# EAGLE design evalboard-005 (EAGLE 6.5.0)
Assembly variants: Standard

## Sheet 1 of 6
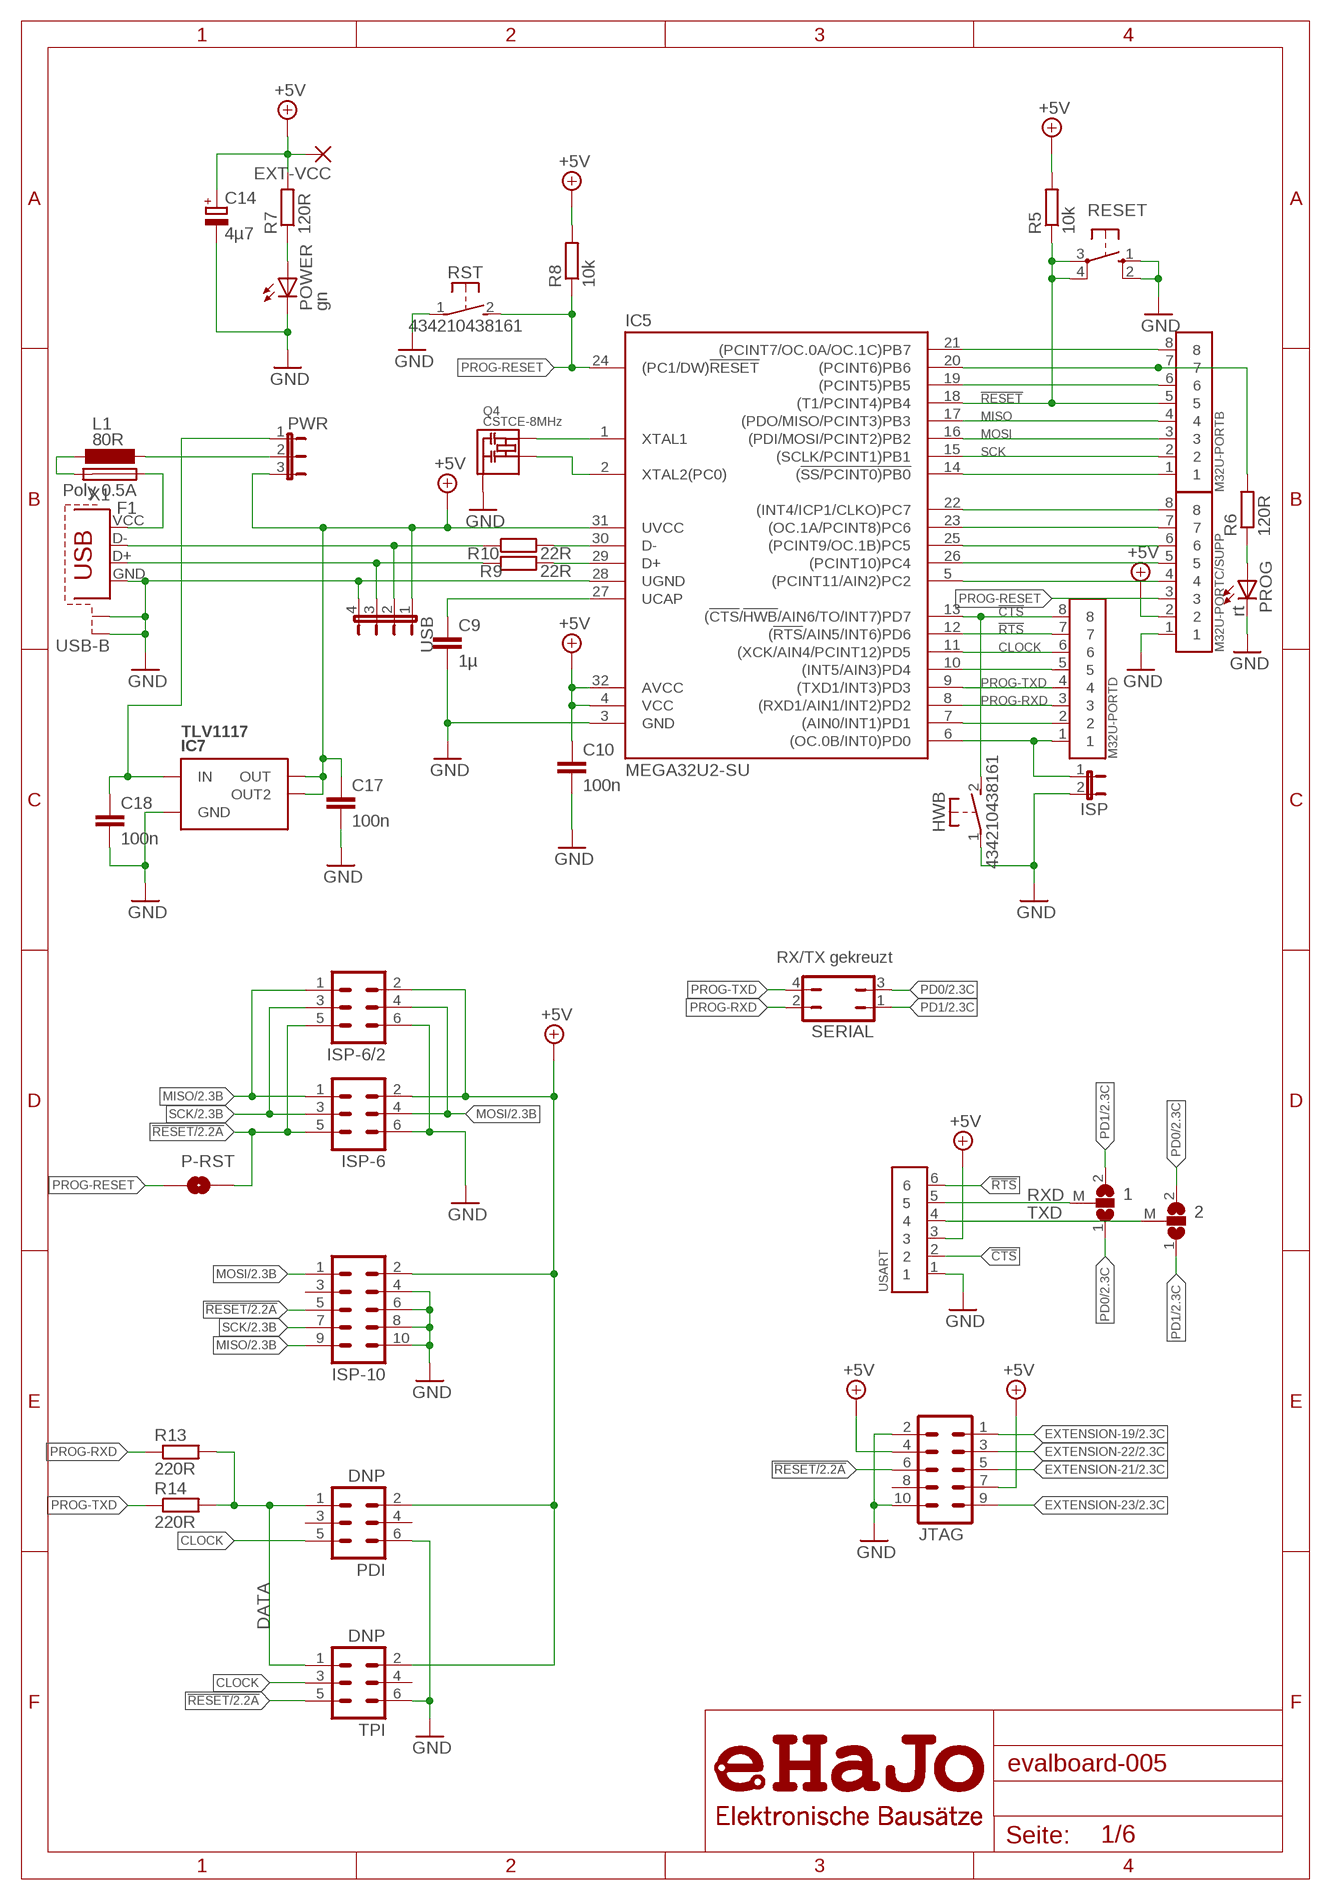
[diagram p0: schematic, sheet 1]

### Parts
1  SJ2WS  [SJ2-S]
2  SJ2WS  [SJ2-S]
C9  1µ  CC0805  [C0805]
C10  100n  CC0805  [C0805]
C14  4µ7  CPOLE2,5-6E  [E2,5-6E]
C17  100n  CC0805  [C0805]
C18  100n  CC0805  [C0805]
EXT-VCC  2,54/1,0  [2,54/1,0]
F1  Poly 0.5A  FUSE1206  [1206]
HWB  434210438161  [WS-TRS-6,0X3,5]
IC5  MEGA32U2-SU  MEGA8U-SU  [TQFP32-08]
IC7  TLV1117  [SOT-223-4]
ISP  JP1E  [JP1]
ISP-6  ML6  [ML6]
ISP-6/2  ML6  [ML6]  (not fitted in variant Standard)
ISP-10  ML10  [ML10]
JTAG  ML10  [ML10]
L1  80R  LL2012C  [L2012C]
M32U-PORTB  JP8E  [JP8E]  (not fitted in variant Standard)
M32U-PORTC/SUPP  JP8E  [JP8E]  (not fitted in variant Standard)
M32U-PORTD  JP8E  [JP8E]  (not fitted in variant Standard)
P-RST  SJS  [SJS]
PDI  DNP  ML6  [ML6]  (not fitted in variant Standard)
POWER  gn  LEDCHIP-LED0805  [CHIP-LED0805]
PROG  rt  LEDCHIP-LED0805  [CHIP-LED0805]
PWR  JP2E  [JP2]
Q4  CSTCE-8MHz  CSTCE  [SMALL-CAP]
R5  10k  RR0805  [R0805]
R6  120R  RR0805  [R0805]
R7  120R  RR0805  [R0805]
R8  10k  RR0805  [R0805]
R9  22R  RR0805  [R0805]
R10  22R  RR0805  [R0805]
R13  220R  RR0805  [R0805]  (not fitted in variant Standard)
R14  220R  RR0805  [R0805]  (not fitted in variant Standard)
RESET  10-XX  [B3F-10XX]
RST  434210438161  [WS-TRS-6,0X3,5]
SERIAL  JP2Q  [JP2Q]
TPI  DNP  ML6  [ML6]  (not fitted in variant Standard)
USART  JP6E  [JP6E]  (not fitted in variant Standard)
USB  JP4E  [JP4]  (not fitted in variant Standard)
X1  USB-B  [PN61729-S]

### Nets
!CTS: HWB.2(S) IC5.13((!CTS!/!HWB!/AIN6/TO/INT7)PD7) M32U-PORTD.8 USART.2
!RESET: IC5.18((T1/PCINT4)PB4) ISP-6.5 ISP-6/2.5 ISP-10.5 JTAG.6 M32U-PORTB.5 P-RST.2 R5.1 RESET.3(P) RESET.4(P1) TPI.5 ; also sheet 2,3,4
!RTS: IC5.12((!RTS!/AIN5/INT6)PD6) M32U-PORTD.7 USART.6
+5V [Supply]: C10.1 C14.+ C17.1 EXT-VCC.1(P) IC5.4(VCC) IC5.31(UVCC) IC5.32(AVCC) IC7.2(OUT) IC7.4(OUT2) ISP-6.2 ISP-6/2.2 ISP-10.2 JTAG.4 JTAG.7 M32U-PORTC/SUPP.2 PDI.2 PWR.3 R5.2 R7.2 R8.2 TPI.2 USART.3 USB.1 ; also sheet 2,3,4,5,6
CLOCK: IC5.11((XCK/AIN4/PCINT12)PD5) M32U-PORTD.6 PDI.5 TPI.3
D+: R9.1 USB.3 X1.D+
D-: R10.1 USB.2 X1.D-
DATA: PDI.1 R13.2 R14.2 TPI.1
EXTENSION-19: JTAG.1 ; also sheet 2,5
EXTENSION-21: JTAG.5 ; also sheet 2,5
EXTENSION-22: JTAG.3 ; also sheet 2,5
EXTENSION-23: JTAG.9 ; also sheet 2,5
GND [Supply]: C9.2 C10.2 C14.- C17.2 C18.2 HWB.1(P) IC5.3(GND) IC5.28(UGND) IC7.1(GND) ISP-6.6 ISP-6/2.6 ISP-10.4 ISP-10.6 ISP-10.8 ISP-10.10 ISP.2 JTAG.2 JTAG.10 M32U-PORTC/SUPP.1 PDI.6 POWER.C PROG.C Q4.2(GND) RESET.1(S) RESET.2(S1) RST.1(P) TPI.6 USART.1 USB.4 X1.GND X1.S1 X1.S2 ; also sheet 2,3,4,5,6
MISO: IC5.17((PDO/MISO/PCINT3)PB3) ISP-6.1 ISP-6/2.1 ISP-10.9 M32U-PORTB.4 ; also sheet 2,3,4,5
MOSI: IC5.16((PDI/MOSI/PCINT2)PB2) ISP-6.4 ISP-6/2.4 ISP-10.1 M32U-PORTB.3 ; also sheet 2,3,4,5
N$1: L1.2 PWR.2
N$3: F1.1 X1.VCC
N$4: IC5.14((!SS/PCINT0)PB0) M32U-PORTB.1
N$5: IC5.30(D-) R10.2
N$6: IC5.29(D+) R9.2
N$9: C9.1 IC5.27(UCAP)
N$11: IC5.19((PCINT5)PB5) M32U-PORTB.6
N$12: C18.1 IC7.3(IN) PWR.1
N$13: IC5.21((PCINT7/OC.0A/OC.1C)PB7) M32U-PORTB.8
N$17: IC5.10((INT5/AIN3)PD4) M32U-PORTD.5
N$20: IC5.7((AIN0/INT1)PD1) M32U-PORTD.2
N$21: IC5.20((PCINT6)PB6) M32U-PORTB.7 R6.2
N$22: IC5.6((OC.0B/INT0)PD0) ISP.1 M32U-PORTD.1
N$23: IC5.22((INT4/ICP1/CLKO)PC7) M32U-PORTC/SUPP.8
N$24: IC5.23((OC.1A/PCINT8)PC6) M32U-PORTC/SUPP.7
N$25: IC5.25((PCINT9/OC.1B)PC5) M32U-PORTC/SUPP.6
N$26: IC5.26((PCINT10)PC4) M32U-PORTC/SUPP.5
N$27: IC5.5((PCINT11/AIN2)PC2) M32U-PORTC/SUPP.4
N$39: PROG.A R6.1
N$40: POWER.A R7.1
N$41: F1.2 L1.1
N$43: IC5.1(XTAL1) Q4.1(Q1)
N$44: IC5.2(XTAL2(PC0)) Q4.3(Q2)
PD0: 1.1 2.2 SERIAL.3 ; also sheet 2,3,4,5
PD1: 1.2 2.1 SERIAL.1 ; also sheet 2,3,4,5
PROG-RESET: IC5.24((PC1/DW)!RESET) M32U-PORTC/SUPP.3 P-RST.1 R8.1 RST.2(S)
PROG-RXD: IC5.8((RXD1/AIN1/INT2)PD2) M32U-PORTD.3 R13.1 SERIAL.2
PROG-TXD: IC5.9((TXD1/INT3)PD3) M32U-PORTD.4 R14.1 SERIAL.4
RXD: 1.M USART.5
SCK: IC5.15((SCLK/PCINT1)PB1) ISP-6.3 ISP-6/2.3 ISP-10.7 M32U-PORTB.2 ; also sheet 2,3,4,5
TXD: 2.M USART.4
Unconnected: ISP-10.3 JTAG.8 PDI.3 PDI.4 TPI.4

### Notes on the sheet
- RX/TX gekreuzt

## Sheet 2 of 6
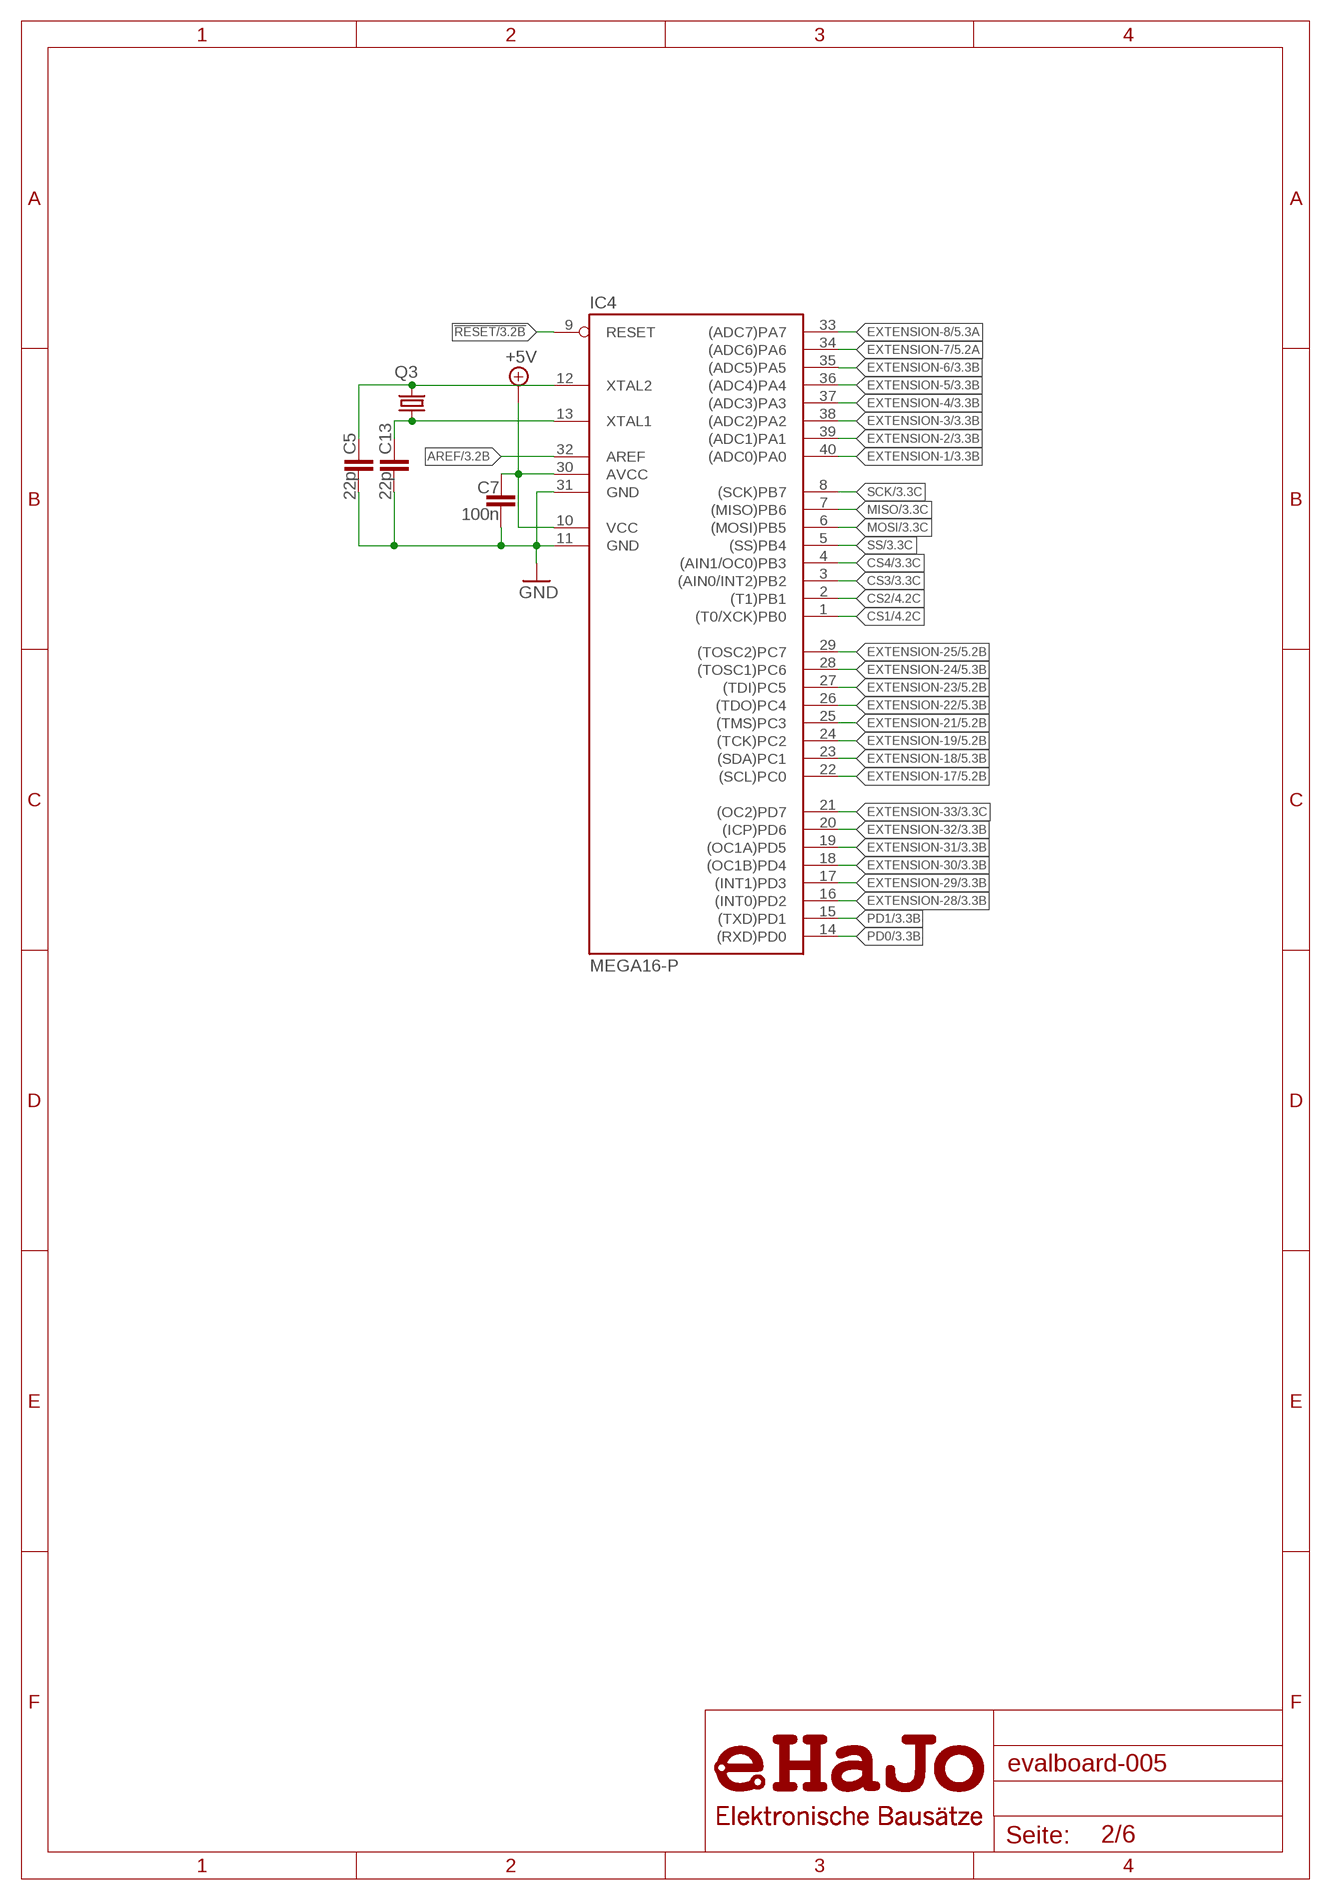
[diagram p1: schematic, sheet 2]

### Parts
C5  22p  CC0805  [C0805]
C7  100n  CC0805  [C0805]
C13  22p  CC0805  [C0805]
IC4  MEGA16-P  [DIL40]
Q3  CRYSTALHC49U70  [HC49U70]

### Nets
!RESET: IC4.9(RESET) ; also sheet 1,3,4
+5V [Supply]: C7.1 IC4.10(VCC) IC4.30(AVCC) ; also sheet 1,3,4,5,6
AREF: IC4.32(AREF) ; also sheet 3,5
CS1: IC4.1((T0/XCK)PB0) ; also sheet 4,5
CS2: IC4.2((T1)PB1) ; also sheet 4,5
CS3: IC4.3((AIN0/INT2)PB2) ; also sheet 3,4,5
CS4: IC4.4((AIN1/OC0)PB3) ; also sheet 3,4,5
EXTENSION-1: IC4.40((ADC0)PA0) ; also sheet 3,5,6
EXTENSION-2: IC4.39((ADC1)PA1) ; also sheet 3,5,6
EXTENSION-3: IC4.38((ADC2)PA2) ; also sheet 3,5
EXTENSION-4: IC4.37((ADC3)PA3) ; also sheet 3,5
EXTENSION-5: IC4.36((ADC4)PA4) ; also sheet 3,5,6
EXTENSION-6: IC4.35((ADC5)PA5) ; also sheet 3,5,6
EXTENSION-7: IC4.34((ADC6)PA6) ; also sheet 5
EXTENSION-8: IC4.33((ADC7)PA7) ; also sheet 5
EXTENSION-17: IC4.22((SCL)PC0) ; also sheet 5,6
EXTENSION-18: IC4.23((SDA)PC1) ; also sheet 5,6
EXTENSION-19: IC4.24((TCK)PC2) ; also sheet 1,5
EXTENSION-21: IC4.25((TMS)PC3) ; also sheet 1,5
EXTENSION-22: IC4.26((TDO)PC4) ; also sheet 1,5
EXTENSION-23: IC4.27((TDI)PC5) ; also sheet 1,5
EXTENSION-24: IC4.28((TOSC1)PC6) ; also sheet 5
EXTENSION-25: IC4.29((TOSC2)PC7) ; also sheet 5
EXTENSION-28: IC4.16((INT0)PD2) ; also sheet 3,4,5,6
EXTENSION-29: IC4.17((INT1)PD3) ; also sheet 3,4,5,6
EXTENSION-30: IC4.18((OC1B)PD4) ; also sheet 3,4,5,6
EXTENSION-31: IC4.19((OC1A)PD5) ; also sheet 3,4,5,6
EXTENSION-32: IC4.20((ICP)PD6) ; also sheet 3,4,5,6
EXTENSION-33: IC4.21((OC2)PD7) ; also sheet 3,5,6
GND [Supply]: C5.2 C7.2 C13.2 IC4.11(GND) IC4.31(GND) ; also sheet 1,3,4,5,6
MISO: IC4.7((MISO)PB6) ; also sheet 1,3,4,5
MOSI: IC4.6((MOSI)PB5) ; also sheet 1,3,4,5
N$19: C5.1 IC4.12(XTAL2) Q3.2
N$28: C13.1 IC4.13(XTAL1) Q3.1
PD0: IC4.14((RXD)PD0) ; also sheet 1,3,4,5
PD1: IC4.15((TXD)PD1) ; also sheet 1,3,4,5
SCK: IC4.8((SCK)PB7) ; also sheet 1,3,4,5
SS: IC4.5((SS)PB4) ; also sheet 3,4,5

## Sheet 3 of 6
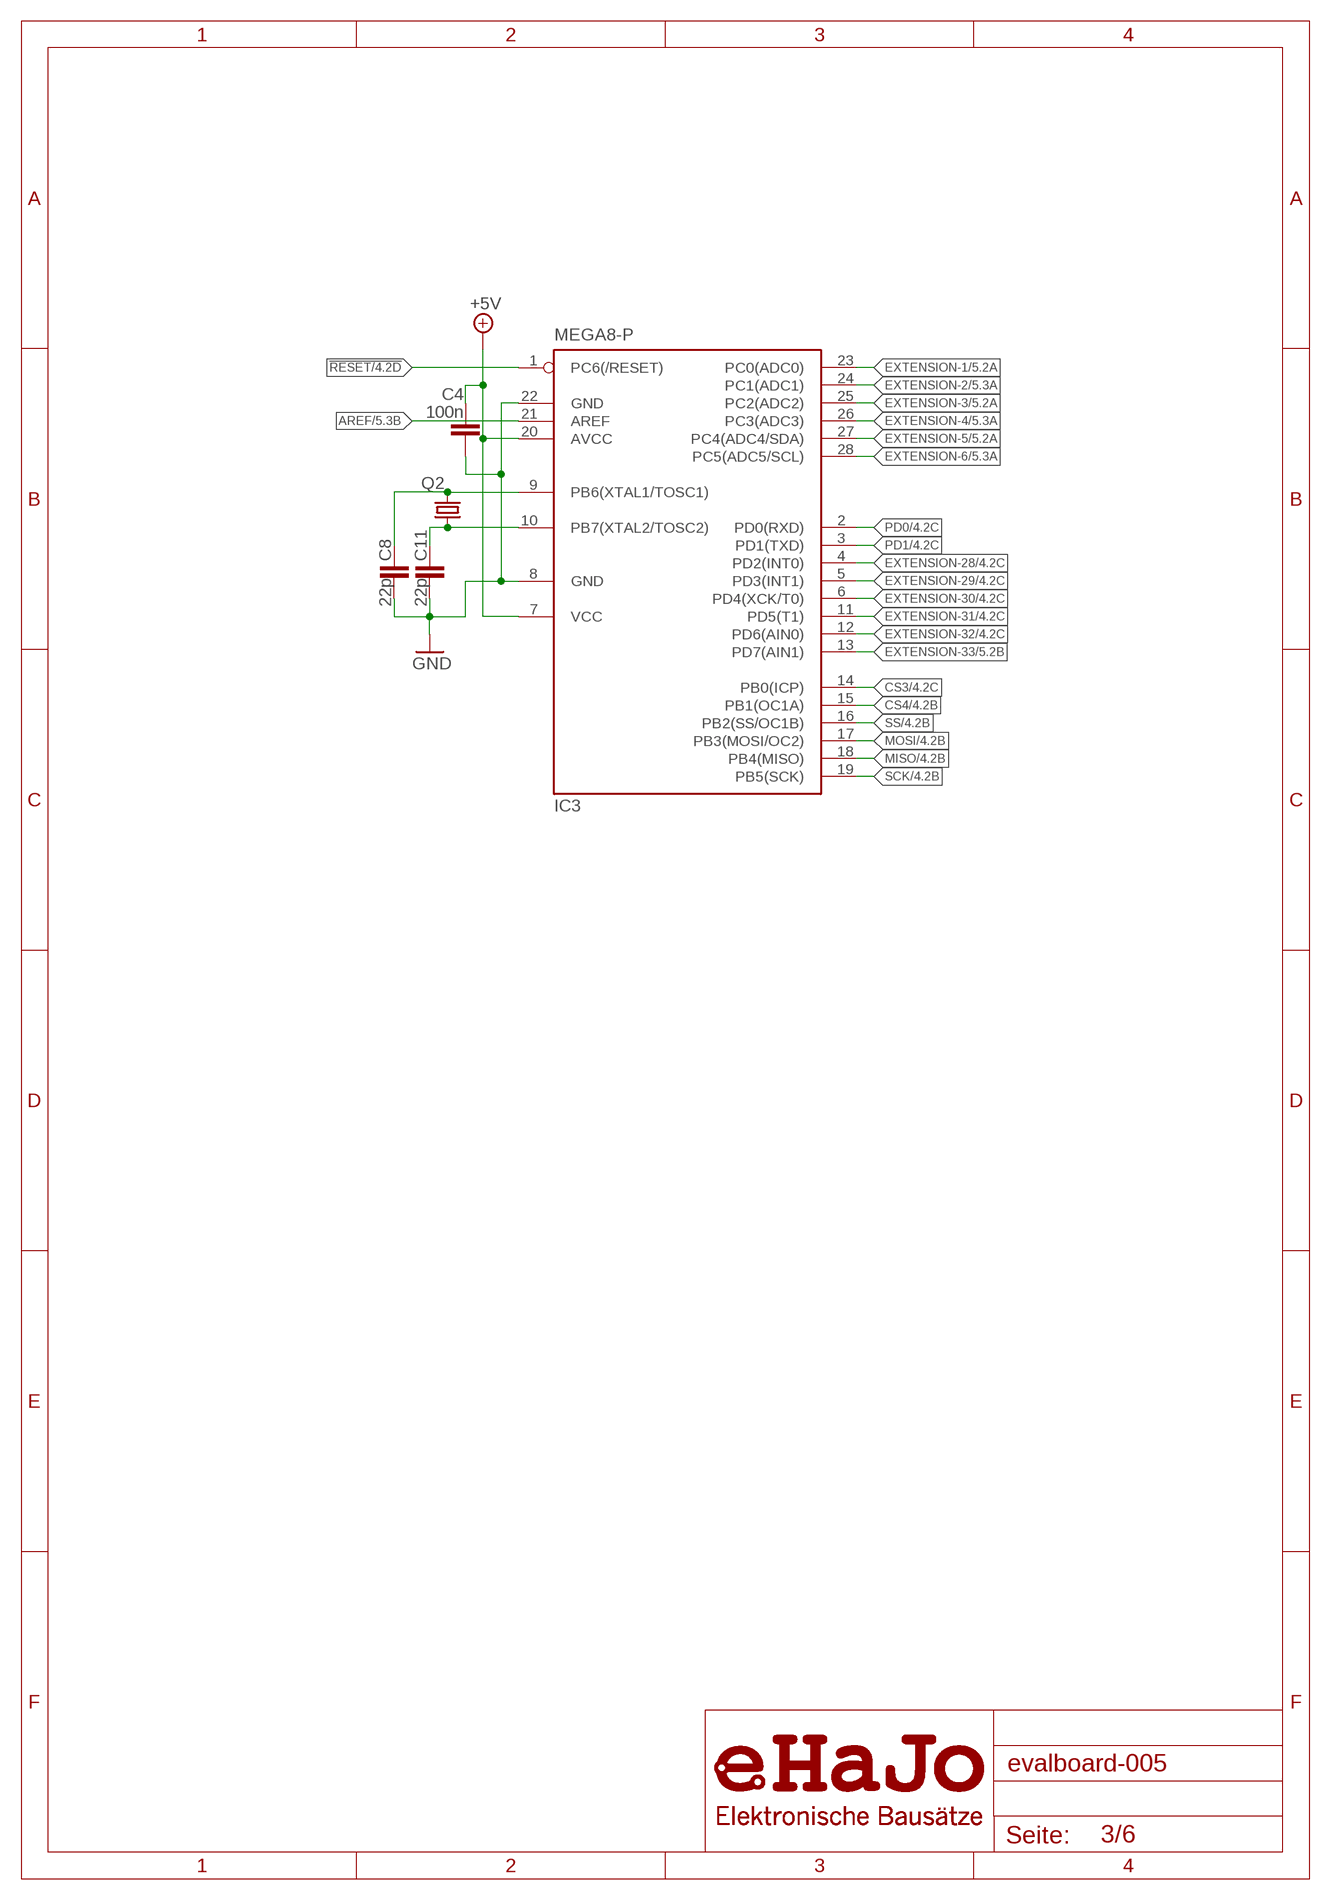
[diagram p2: schematic, sheet 3]

### Parts
C4  100n  CC0805  [C0805]
C8  22p  CC0805  [C0805]
C11  22p  CC0805  [C0805]
IC3  MEGA8-P  [DIL28-3]
Q2  CRYSTALHC49U70  [HC49U70]

### Nets
!RESET: IC3.1(PC6(/RESET)) ; also sheet 1,2,4
+5V [Supply]: C4.1 IC3.7(VCC) IC3.20(AVCC) ; also sheet 1,2,4,5,6
AREF: IC3.21(AREF) ; also sheet 2,5
CS3: IC3.14(PB0(ICP)) ; also sheet 2,4,5
CS4: IC3.15(PB1(OC1A)) ; also sheet 2,4,5
EXTENSION-1: IC3.23(PC0(ADC0)) ; also sheet 2,5,6
EXTENSION-2: IC3.24(PC1(ADC1)) ; also sheet 2,5,6
EXTENSION-3: IC3.25(PC2(ADC2)) ; also sheet 2,5
EXTENSION-4: IC3.26(PC3(ADC3)) ; also sheet 2,5
EXTENSION-5: IC3.27(PC4(ADC4/SDA)) ; also sheet 2,5,6
EXTENSION-6: IC3.28(PC5(ADC5/SCL)) ; also sheet 2,5,6
EXTENSION-28: IC3.4(PD2(INT0)) ; also sheet 2,4,5,6
EXTENSION-29: IC3.5(PD3(INT1)) ; also sheet 2,4,5,6
EXTENSION-30: IC3.6(PD4(XCK/T0)) ; also sheet 2,4,5,6
EXTENSION-31: IC3.11(PD5(T1)) ; also sheet 2,4,5,6
EXTENSION-32: IC3.12(PD6(AIN0)) ; also sheet 2,4,5,6
EXTENSION-33: IC3.13(PD7(AIN1)) ; also sheet 2,5,6
GND [Supply]: C4.2 C8.2 C11.2 IC3.8(GND) IC3.22(GND) ; also sheet 1,2,4,5,6
MISO: IC3.18(PB4(MISO)) ; also sheet 1,2,4,5
MOSI: IC3.17(PB3(MOSI/OC2)) ; also sheet 1,2,4,5
N$10: C8.1 IC3.9(PB6(XTAL1/TOSC1)) Q2.2
N$18: C11.1 IC3.10(PB7(XTAL2/TOSC2)) Q2.1
PD0: IC3.2(PD0(RXD)) ; also sheet 1,2,4,5
PD1: IC3.3(PD1(TXD)) ; also sheet 1,2,4,5
SCK: IC3.19(PB5(SCK)) ; also sheet 1,2,4,5
SS: IC3.16(PB2(SS/OC1B)) ; also sheet 2,4,5

## Sheet 4 of 6
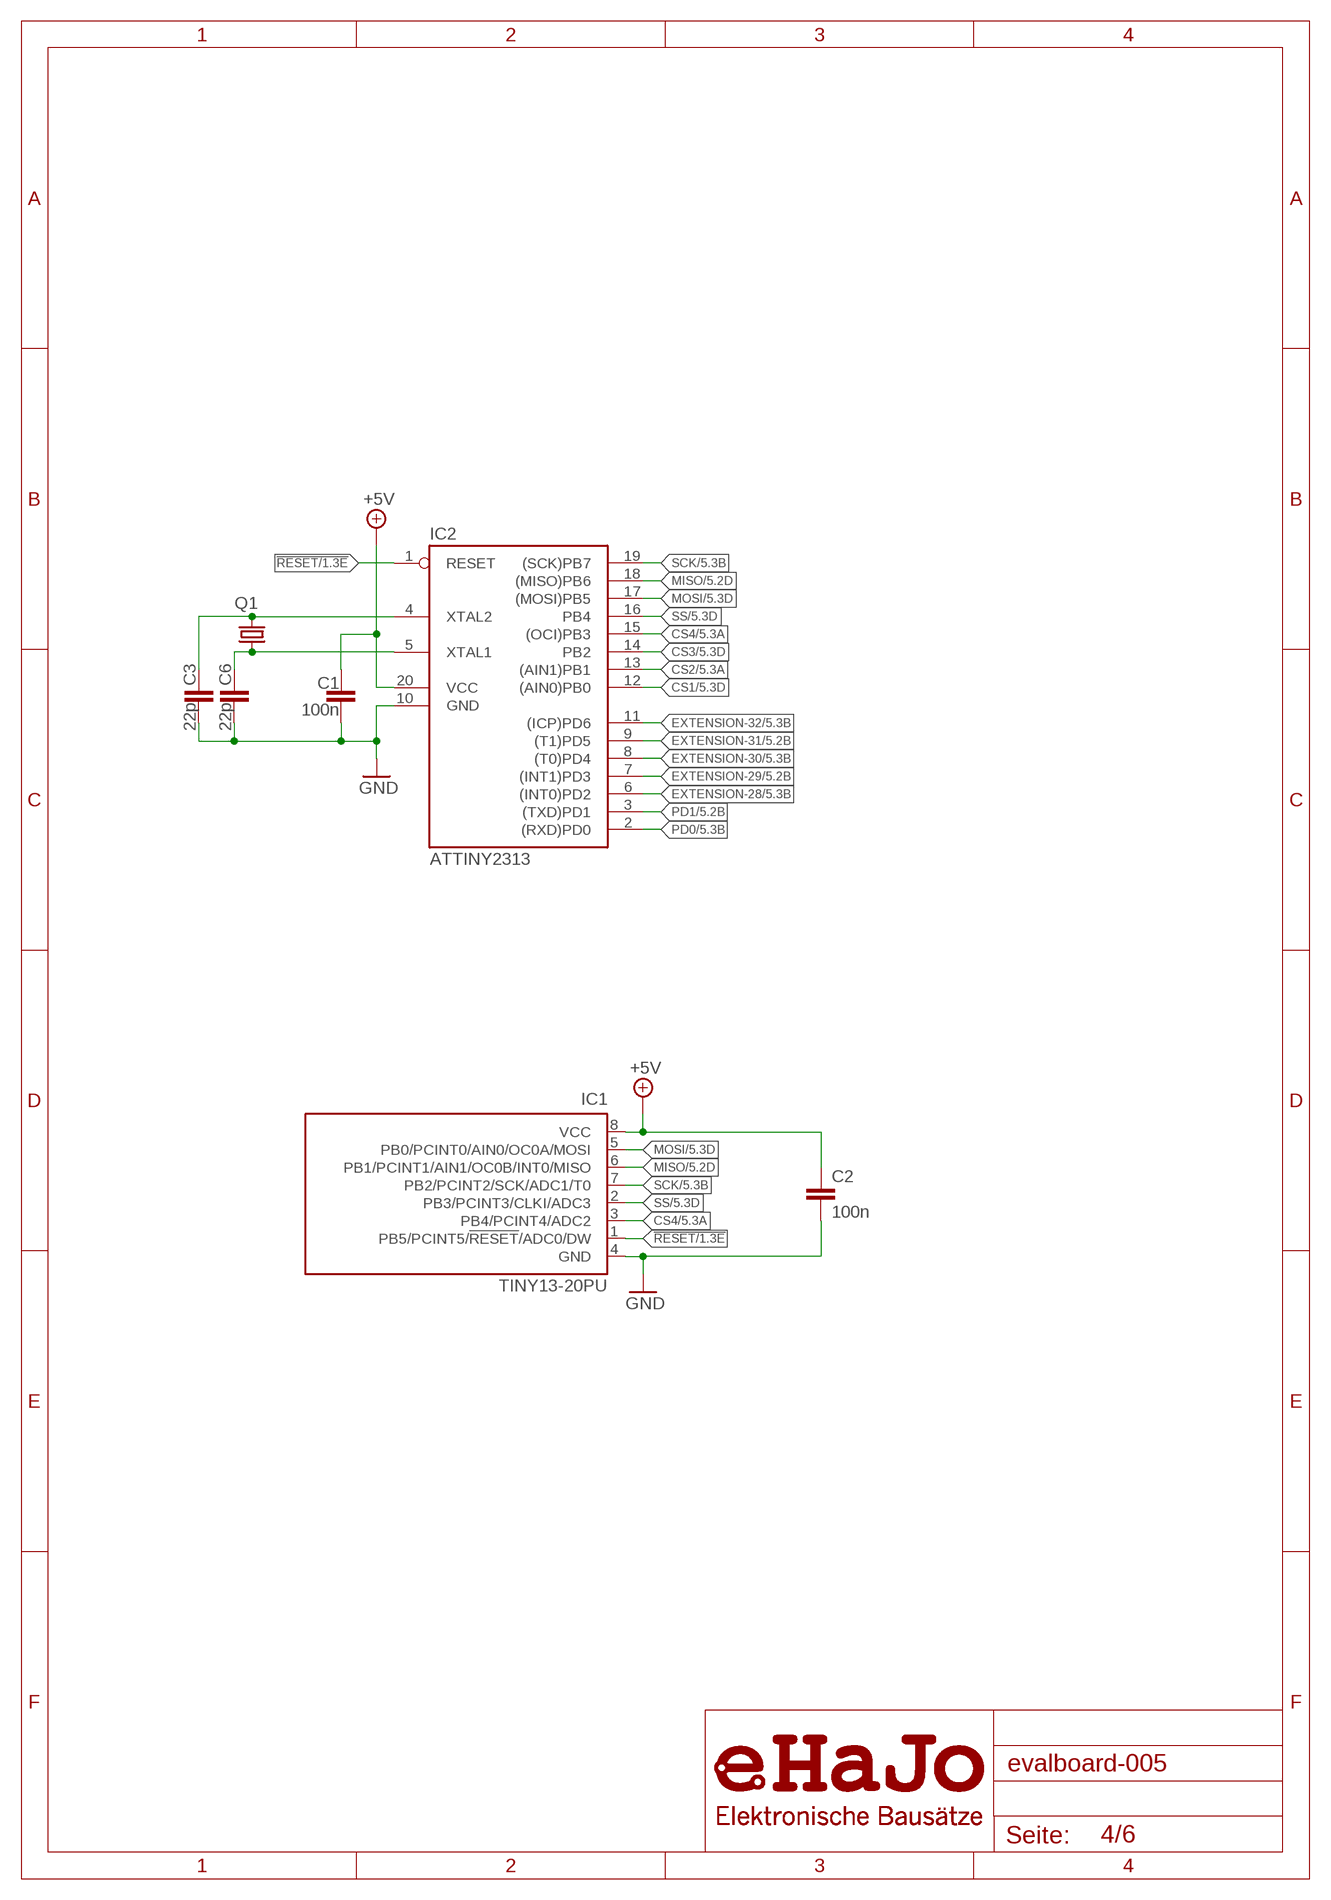
[diagram p3: schematic, sheet 4]

### Parts
C1  100n  CC0805  [C0805]
C2  100n  CC0805  [C0805]
C3  22p  CC0805  [C0805]
C6  22p  CC0805  [C0805]
IC1  TINY13-20PU  [DIL08]
IC2  ATTINY2313  AT90S2313P  [DIL20]
Q1  CRYSTALHC49U70  [HC49U70]

### Nets
!RESET: IC1.1(PB5/PCINT5/!RESET!/ADC0/DW) IC2.1(RESET) ; also sheet 1,2,3
+5V [Supply]: C1.1 C2.1 IC1.8(VCC) IC2.20(VCC) ; also sheet 1,2,3,5,6
CS1: IC2.12((AIN0)PB0) ; also sheet 2,5
CS2: IC2.13((AIN1)PB1) ; also sheet 2,5
CS3: IC2.14(PB2) ; also sheet 2,3,5
CS4: IC1.3(PB4/PCINT4/ADC2) IC2.15((OCI)PB3) ; also sheet 2,3,5
EXTENSION-28: IC2.6((INT0)PD2) ; also sheet 2,3,5,6
EXTENSION-29: IC2.7((INT1)PD3) ; also sheet 2,3,5,6
EXTENSION-30: IC2.8((T0)PD4) ; also sheet 2,3,5,6
EXTENSION-31: IC2.9((T1)PD5) ; also sheet 2,3,5,6
EXTENSION-32: IC2.11((ICP)PD6) ; also sheet 2,3,5,6
GND [Supply]: C1.2 C2.2 C3.2 C6.2 IC1.4(GND) IC2.10(GND) ; also sheet 1,2,3,5,6
MISO: IC1.6(PB1/PCINT1/AIN1/OC0B/INT0/MISO) IC2.18((MISO)PB6) ; also sheet 1,2,3,5
MOSI: IC1.5(PB0/PCINT0/AIN0/OC0A/MOSI) IC2.17((MOSI)PB5) ; also sheet 1,2,3,5
N$29: C3.1 IC2.4(XTAL2) Q1.2
N$30: C6.1 IC2.5(XTAL1) Q1.1
PD0: IC2.2((RXD)PD0) ; also sheet 1,2,3,5
PD1: IC2.3((TXD)PD1) ; also sheet 1,2,3,5
SCK: IC1.7(PB2/PCINT2/SCK/ADC1/T0) IC2.19((SCK)PB7) ; also sheet 1,2,3,5
SS: IC1.2(PB3/PCINT3/CLKI/ADC3) IC2.16(PB4) ; also sheet 2,3,5

## Sheet 5 of 6
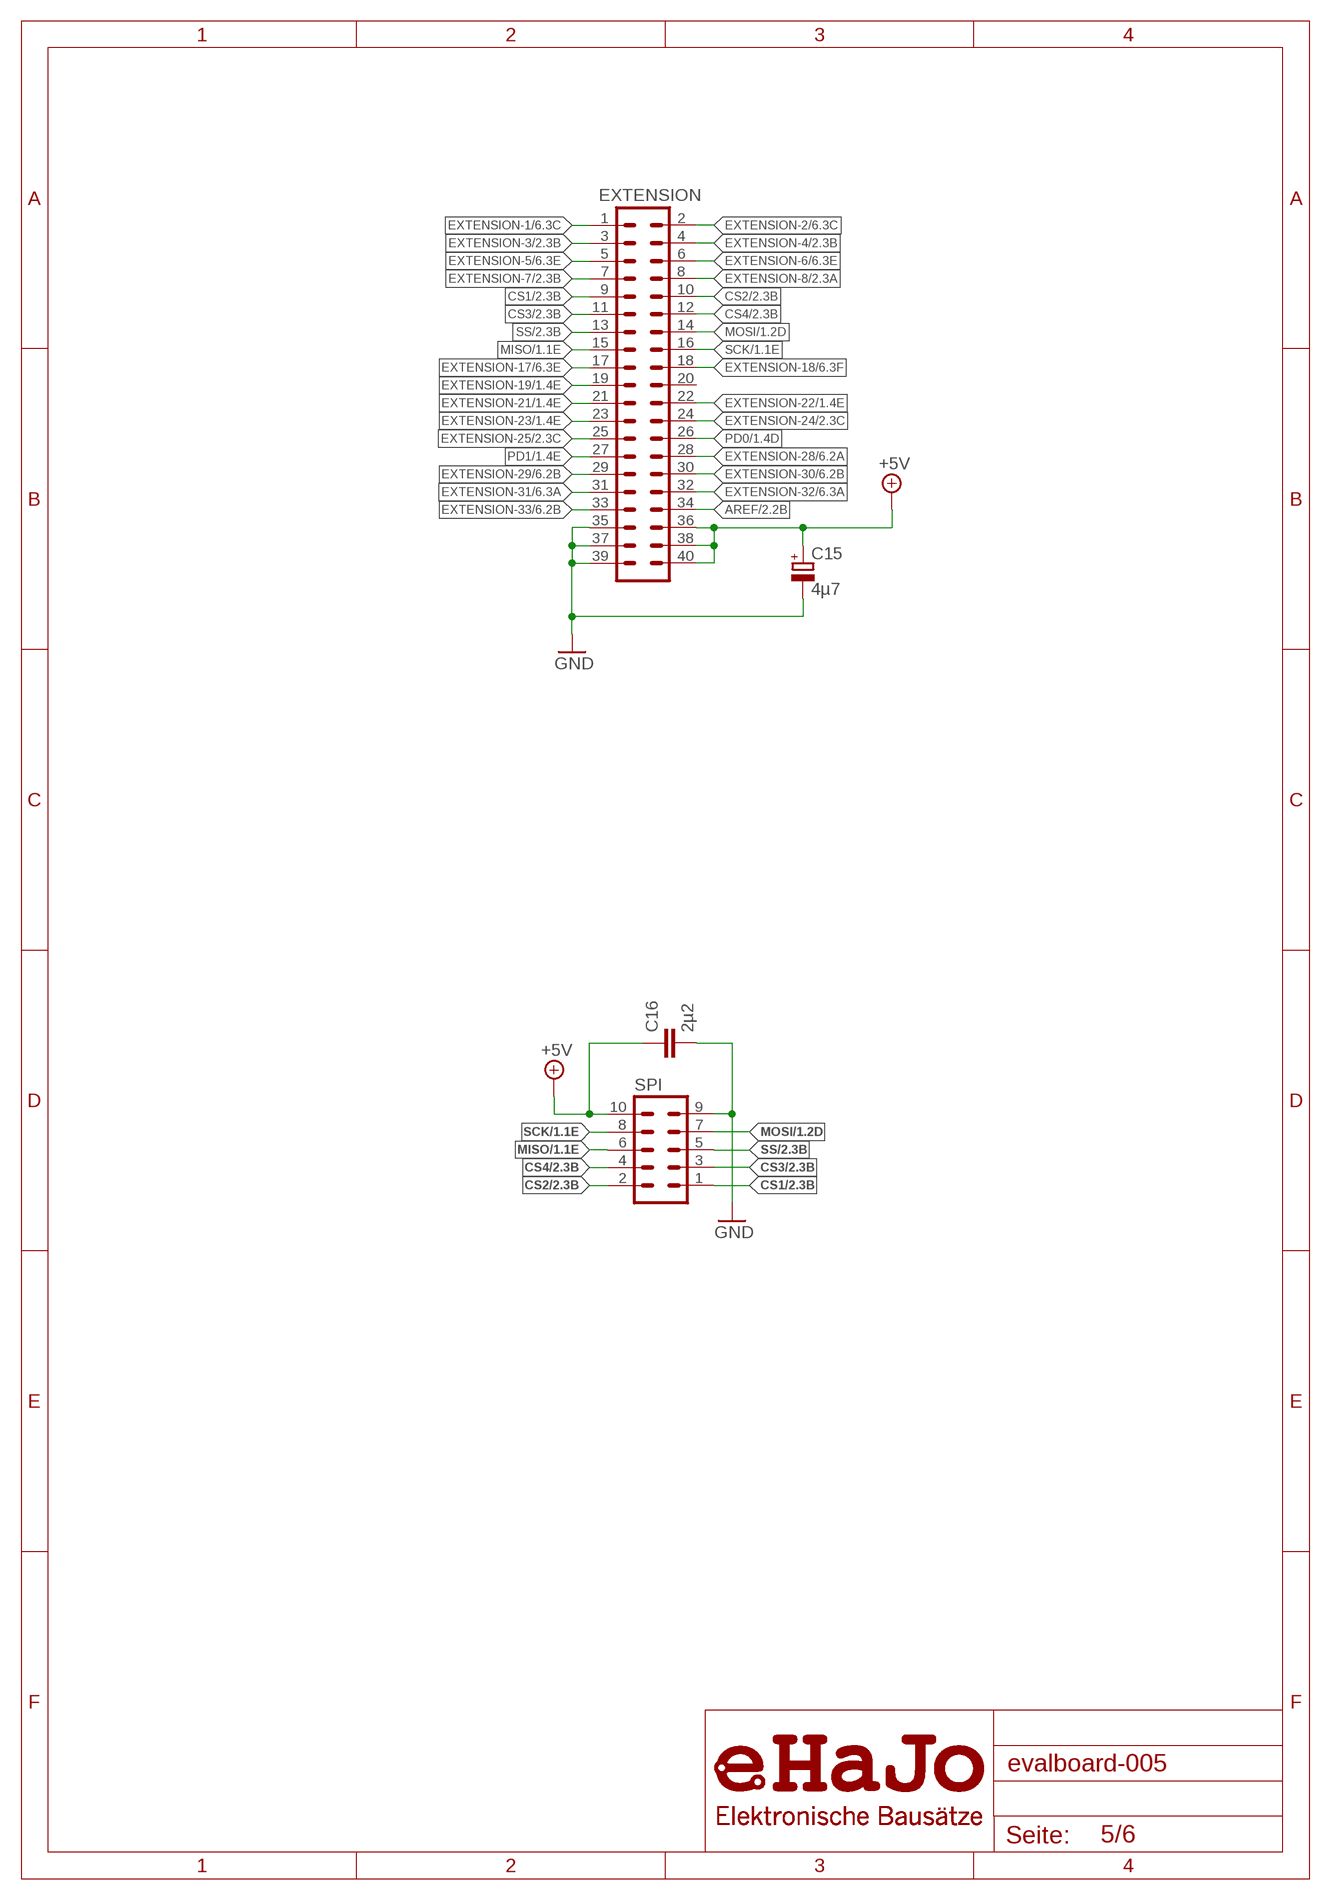
[diagram p4: schematic, sheet 5]

### Parts
C15  4µ7  CPOLE2,5-6E  [E2,5-6E]
C16  2µ2  CC0805  [C0805]
EXTENSION  ML40  [ML40]
SPI  ML10  [ML10]

### Nets
+5V [Supply]: C15.+ C16.1 EXTENSION.36 EXTENSION.38 EXTENSION.40 SPI.10 ; also sheet 1,2,3,4,6
AREF: EXTENSION.34 ; also sheet 2,3
CS1: EXTENSION.9 SPI.1 ; also sheet 2,4
CS2: EXTENSION.10 SPI.2 ; also sheet 2,4
CS3: EXTENSION.11 SPI.3 ; also sheet 2,3,4
CS4: EXTENSION.12 SPI.4 ; also sheet 2,3,4
EXTENSION-1: EXTENSION.1 ; also sheet 2,3,6
EXTENSION-2: EXTENSION.2 ; also sheet 2,3,6
EXTENSION-3: EXTENSION.3 ; also sheet 2,3
EXTENSION-4: EXTENSION.4 ; also sheet 2,3
EXTENSION-5: EXTENSION.5 ; also sheet 2,3,6
EXTENSION-6: EXTENSION.6 ; also sheet 2,3,6
EXTENSION-7: EXTENSION.7 ; also sheet 2
EXTENSION-8: EXTENSION.8 ; also sheet 2
EXTENSION-17: EXTENSION.17 ; also sheet 2,6
EXTENSION-18: EXTENSION.18 ; also sheet 2,6
EXTENSION-19: EXTENSION.19 ; also sheet 1,2
EXTENSION-21: EXTENSION.21 ; also sheet 1,2
EXTENSION-22: EXTENSION.22 ; also sheet 1,2
EXTENSION-23: EXTENSION.23 ; also sheet 1,2
EXTENSION-24: EXTENSION.24 ; also sheet 2
EXTENSION-25: EXTENSION.25 ; also sheet 2
EXTENSION-28: EXTENSION.28 ; also sheet 2,3,4,6
EXTENSION-29: EXTENSION.29 ; also sheet 2,3,4,6
EXTENSION-30: EXTENSION.30 ; also sheet 2,3,4,6
EXTENSION-31: EXTENSION.31 ; also sheet 2,3,4,6
EXTENSION-32: EXTENSION.32 ; also sheet 2,3,4,6
EXTENSION-33: EXTENSION.33 ; also sheet 2,3,6
GND [Supply]: C15.- C16.2 EXTENSION.35 EXTENSION.37 EXTENSION.39 SPI.9 ; also sheet 1,2,3,4,6
MISO: EXTENSION.15 SPI.6 ; also sheet 1,2,3,4
MOSI: EXTENSION.14 SPI.7 ; also sheet 1,2,3,4
PD0: EXTENSION.26 ; also sheet 1,2,3,4
PD1: EXTENSION.27 ; also sheet 1,2,3,4
SCK: EXTENSION.16 SPI.8 ; also sheet 1,2,3,4
SS: EXTENSION.13 SPI.5 ; also sheet 2,3,4
Unconnected: EXTENSION.20

## Sheet 6 of 6
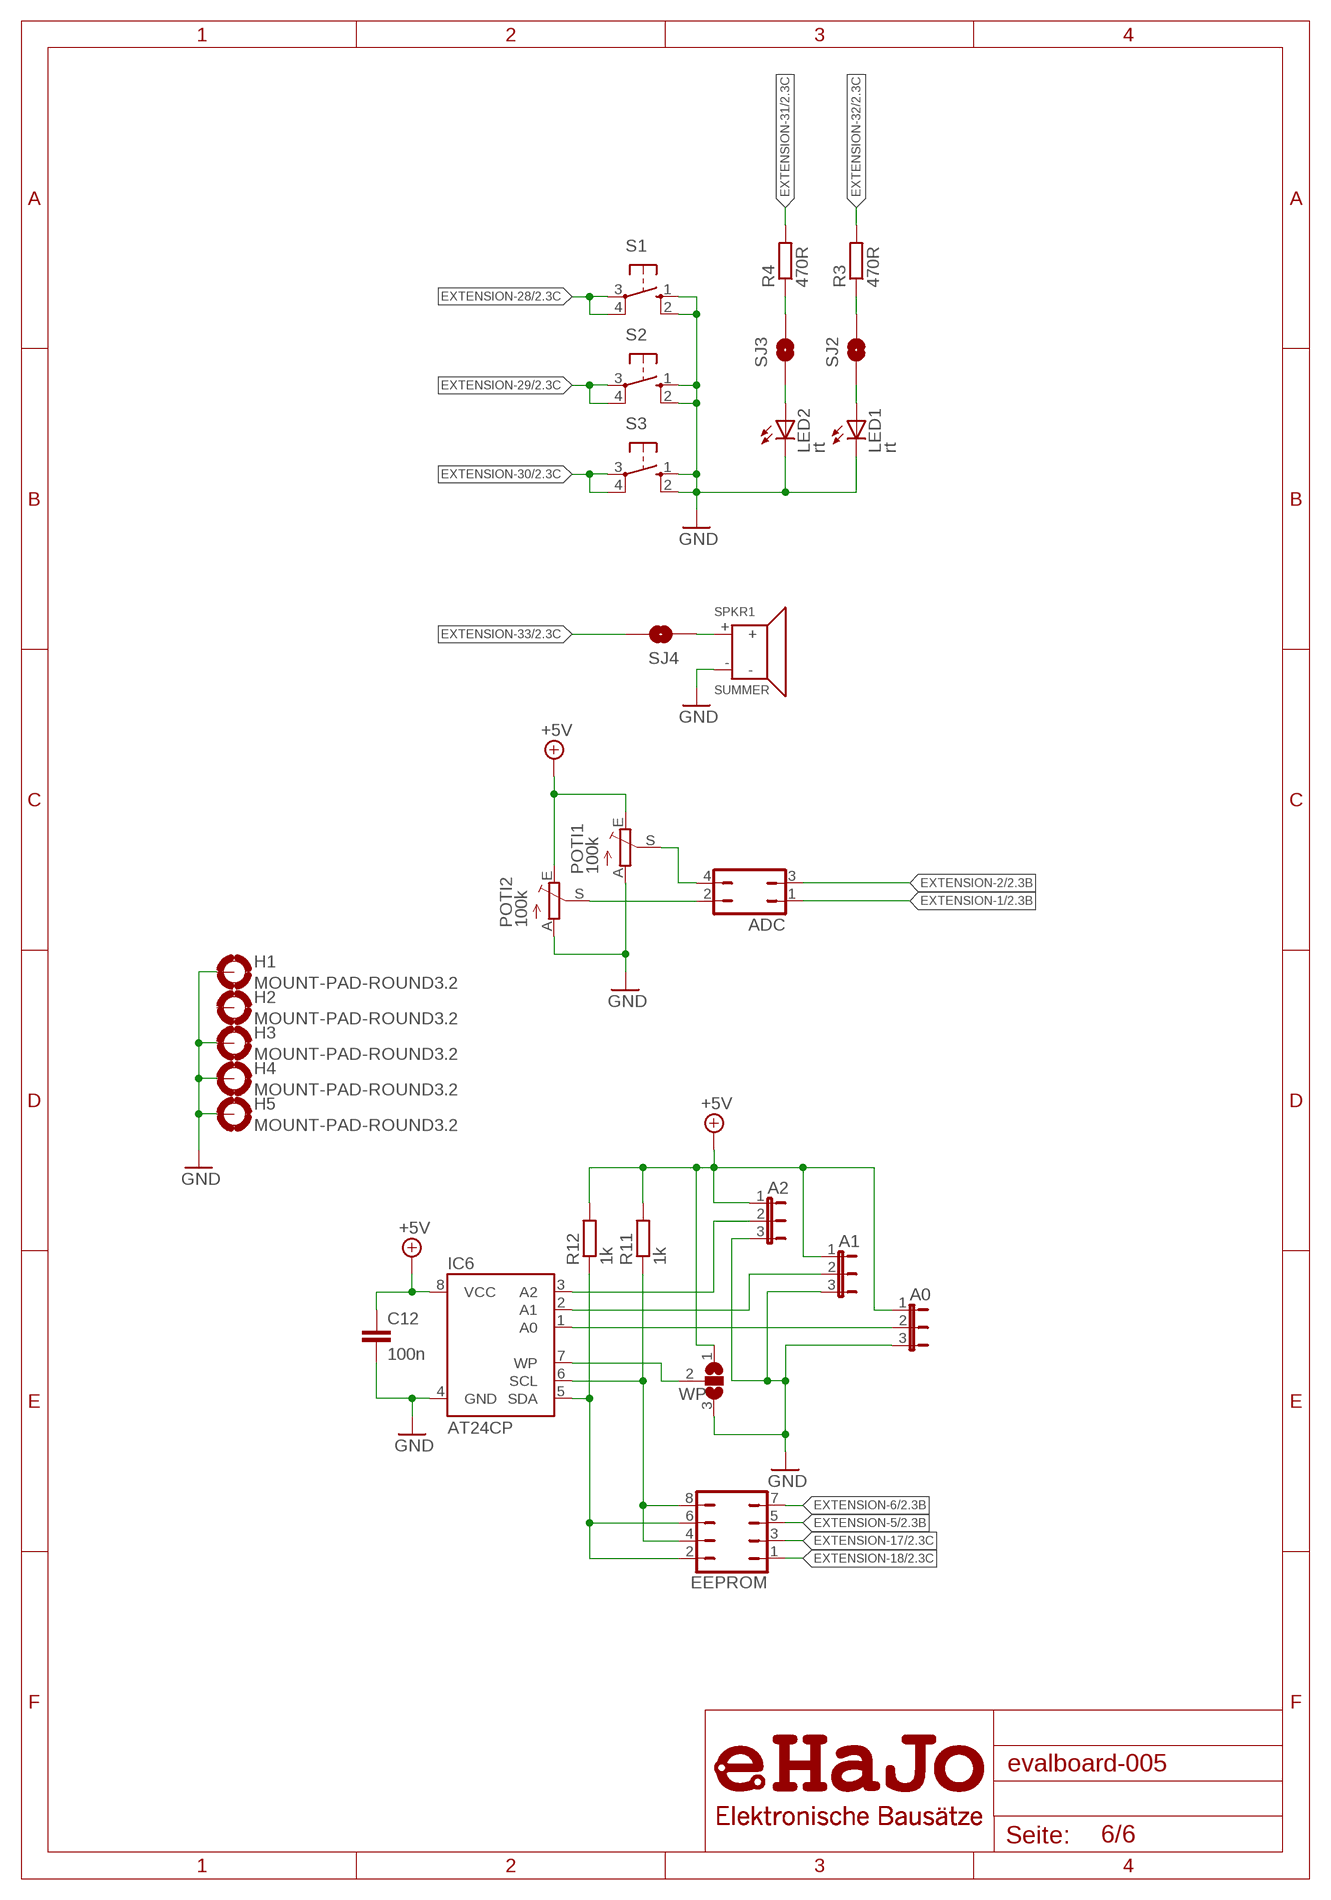
[diagram p5: schematic, sheet 6]

### Parts
A0  JP2E  [JP2]
A1  JP2E  [JP2]
A2  JP2E  [JP2]
ADC  JP2Q  [JP2Q]
C12  100n  CC0805  [C0805]
EEPROM  JP4Q  [JP4Q]
H1  MOUNT-PAD-ROUND3.2  [3,2-PAD]
H2  MOUNT-PAD-ROUND3.2  [3,2-PAD]
H3  MOUNT-PAD-ROUND3.2  [3,2-PAD]
H4  MOUNT-PAD-ROUND3.2  [3,2-PAD]
H5  MOUNT-PAD-ROUND3.2  [3,2-PAD]
IC6  AT24CP  [DIL08]
LED1  rt  LED5MM  [LED5MM]
LED2  rt  LED5MM  [LED5MM]
POTI1  100k  POTIPT6  [PT-6]
POTI2  100k  POTIPT6  [PT-6]
R3  470R  RR0805  [R0805]
R4  470R  RR0805  [R0805]
R11  1k  RR0805  [R0805]
R12  1k  RR0805  [R0805]
S1  10-XX  [B3F-10XX]
S2  10-XX  [B3F-10XX]
S3  10-XX  [B3F-10XX]
SJ2  SJS  [SJS]
SJ3  SJS  [SJS]
SJ4  SJS  [SJS]
SPKR1  SUMMER  [SUMMER]
WP  SJ2W  [SJ_2]

### Nets
+5V [Supply]: A0.1 A1.1 A2.1 C12.1 IC6.8(VCC) POTI1.E POTI2.E R11.2 R12.2 WP.1 ; also sheet 1,2,3,4,5
A0: A0.2 IC6.1(A0)
EXTENSION-1: ADC.1 ; also sheet 2,3,5
EXTENSION-2: ADC.3 ; also sheet 2,3,5
EXTENSION-5: EEPROM.5 ; also sheet 2,3,5
EXTENSION-6: EEPROM.7 ; also sheet 2,3,5
EXTENSION-17: EEPROM.3 ; also sheet 2,5
EXTENSION-18: EEPROM.1 ; also sheet 2,5
EXTENSION-28: S1.3(P) S1.4(P1) ; also sheet 2,3,4,5
EXTENSION-29: S2.3(P) S2.4(P1) ; also sheet 2,3,4,5
EXTENSION-30: S3.3(P) S3.4(P1) ; also sheet 2,3,4,5
EXTENSION-31: R4.2 ; also sheet 2,3,4,5
EXTENSION-32: R3.2 ; also sheet 2,3,4,5
EXTENSION-33: SJ4.2 ; also sheet 2,3,5
GND [Supply]: A0.3 A1.3 A2.3 C12.2 H1.B3,2(MOUNT) H3.B3,2(MOUNT) H4.B3,2(MOUNT) H5.B3,2(MOUNT) IC6.4(GND) LED1.K(C) LED2.K(C) POTI1.A POTI2.A S1.1(S) S1.2(S1) S2.1(S) S2.2(S1) S3.1(S) S3.2(S1) SPKR1.- WP.3 ; also sheet 1,2,3,4,5
N$31: R4.1 SJ3.2
N$32: R3.1 SJ2.2
N$33: A2.2 IC6.3(A2)
N$34: A1.2 IC6.2(A1)
N$35: EEPROM.2 EEPROM.6 IC6.5(SDA) R12.1
N$36: EEPROM.4 EEPROM.8 IC6.6(SCL) R11.1
N$37: ADC.4 POTI1.S
N$38: ADC.2 POTI2.S
N$42: IC6.7(WP) WP.2
N$45: LED2.A SJ3.1
N$46: LED1.A SJ2.1
N$47: SJ4.1 SPKR1.+
Unconnected: H2.B3,2(MOUNT)

## Library data of the parts
1 2 WP = jumper:SJ2W: SMD solder JUMPER
A0 A1 A2 PWR = jumper:JP2E: JUMPER
ADC SERIAL = jumper:JP2Q: JUMPER
C1-C13 C16-C18 = rcl:C: CAPACITOR, European symbol
C14 C15 = rcl:CPOL: POLARIZED CAPACITOR, European symbol
EEPROM = jumper:JP4Q: JUMPER
EXT-VCC = wirepad:2,54/1,0: THROUGH-HOLE PAD
EXTENSION = con-ml:ML40: HARTING; OC_FARNELL: unknown; OC_NEWARK: unknown
F1 = fuse:FUSE: Fuse
H1-H5 = holes:MOUNT-PAD-ROUND: MOUNTING PAD, round
HWB RST = switch-we:434; FARBE: schwarz; HOEHE: 4,3mm; KRAFT: 160g
IC1 = atmel:TINY13: 8-bit AVR Microcontroller with 1K Bytes In-System Programmable Flash Source: http://www.atmel.com/dyn/resources/prod_documents/2535S.pdf
IC2 = atmel:AT90S2313: MICROCONTROLLER 2 Kbytes FLASH 128 bytes SRAM 128 bytes EEPROM UART
IC3 = atmel:MEGA8-P: MICROCONTROLLER 8 Kbytes FLASH, 1 kbytes SRAM, 512 bytes EEPROM, USART, 4-channel 10 bit ADC, 2-channel 8 bit ADC Pin compatible with Atmega48, ATMega88, ATMega168 Source: avr.lbr
IC4 = atmel:MEGA16-P: MICROCONTROLLER 16 Kbytes FLASH 1 kbytes SRAM 512 bytes EEPROM USART 8-channel 10 bit ADC Source: avr.lbr
IC5 = atmel:MEGA8U
IC6 = atmel:AT24C*: 2-wire serial EEPROM
IC7 = texas:TLV1117
ISP = jumper:JP1E: JUMPER
ISP-6 ISP-6/2 PDI TPI = con-ml:ML6: HARTING; OC_FARNELL: unknown; OC_NEWARK: unknown
ISP-10 JTAG SPI = con-ml:ML10: HARTING; OC_FARNELL: unknown; OC_NEWARK: unknown
L1 = rcl:L: INDUCTOR, European symbol
LED1 LED2 POWER PROG = led:LED: LED OSRAM: - CHIPLED LG R971, LG N971, LY N971, LG Q971, LY Q971, LO R971, LY R971 LH N974, LH R974 LS Q976, LO Q976, LY Q976 LO Q996 - Hyper CHIPLED LW Q18S LB Q993, LB Q99A, LB R99A - SideLED LS A670, LO A670, LY A670, LG A670, LP A670 LB A673, LV A673, LT A673, LW A673 LH A674 LY A675 LS A676, LA A676, LO A676, LY A676, LW A676 LS A679, LY A679, LG A679 - Hyper Micro SIDELED® LS Y876, LA Y876, LO Y876, LY Y876 LT Y87S - SmartLED LW L88C, LW L88S LB L89C, LB L89S, LG L890 LS L89K, LO L89K, LY L89K LS L896, LA L896, LO L896, LY L896 - TOPLED LS T670, LO T670, LY T670, LG T670, LP T670 LSG T670, LSP T670, LSY T670, LOP T670, LYG T670 LG T671, LOG T671, LSG T671 LB T673, LV T673, LT T673, LW T673 LH T674 LS T676, LA T676, LO T676, LY T676, LB T676, LH T676, LSB T676, LW T676 LB T67C, LV T67C, LT T67C, LS T67K, LO T67K, LY T67K, LW E67C LS E67B, LA E67B, LO E67B, LY E67B, LB E67C, LV E67C, LT E67C LW T67C LS T679, LY T679, LG T679 LS T770, LO T770, LY T770, LG T770, LP T770 LB T773, LV T773, LT T773, LW T773 LH T774 LS E675, LA E675, LY E675, LS T675 LS T776, LA T776, LO T776, LY T776, LB T776 LHGB T686 LT T68C, LB T68C - Hyper Mini TOPLED® LB M676 - Mini TOPLED Santana® LG M470 LS M47K, LO M47K, LY M47K Source: http://www.osram.convergy.de LUXEON: - LUMILED® LXK2-PW12-R00, LXK2-PW12-S00, LXK2-PW14-U00, LXK2-PW14-V00 LXK2-PM12-R00, LXK2-PM12-S00, LXK2-PM14-U00 LXK2-PE12-Q00, LXK2-PE12-R00, LXK2-PE12-S00, LXK2-PE14-T00, LXK2-PE14-U00 LXK2-PB12-K00, LXK2-PB12-L00, LXK2-PB12-M00, LXK2-PB14-N00, LXK2-PB14-P00, LXK2-PB14-Q00 LXK2-PR12-L00, LXK2-PR12-M00, LXK2-PR14-Q00, LXK2-PR14-R00 LXK2-PD12-Q00, LXK2-PD12-R00, LXK2-PD12-S00 LXK2-PH12-R00, LXK2-PH12-S00 LXK2-PL12-P00, LXK2-PL12-Q00, LXK2-PL12-R00 Source: www.luxeon.com KINGBRIGHT: KA-3528ASYC Source: www.kingbright.com
M32U-PORTB M32U-PORTC/SUPP M32U-PORTD = jumper:JP8E
P-RST SJ2-SJ4 = jumper:SJ: SMD solder JUMPER
POTI1 POTI2 = pot:POTI: POTENTIOMETER
Q1-Q3 = crystal:CRYSTAL: CRYSTAL
Q4 = resonator:CSTCE
R3-R14 = rcl:R: RESISTOR, European symbol
RESET S1-S3 = switch-omron:10-XX: OMRON SWITCH
SPKR1 = mechanic:SUMMER
USART = jumper:JP6E
USB = jumper:JP4E: JUMPER
X1 = connectors:USB-B: BERG USB connector

## Net classes
1 Supply: width 0.305 mm, drill 0.4 mm, clearance 0.203 mm

## Board
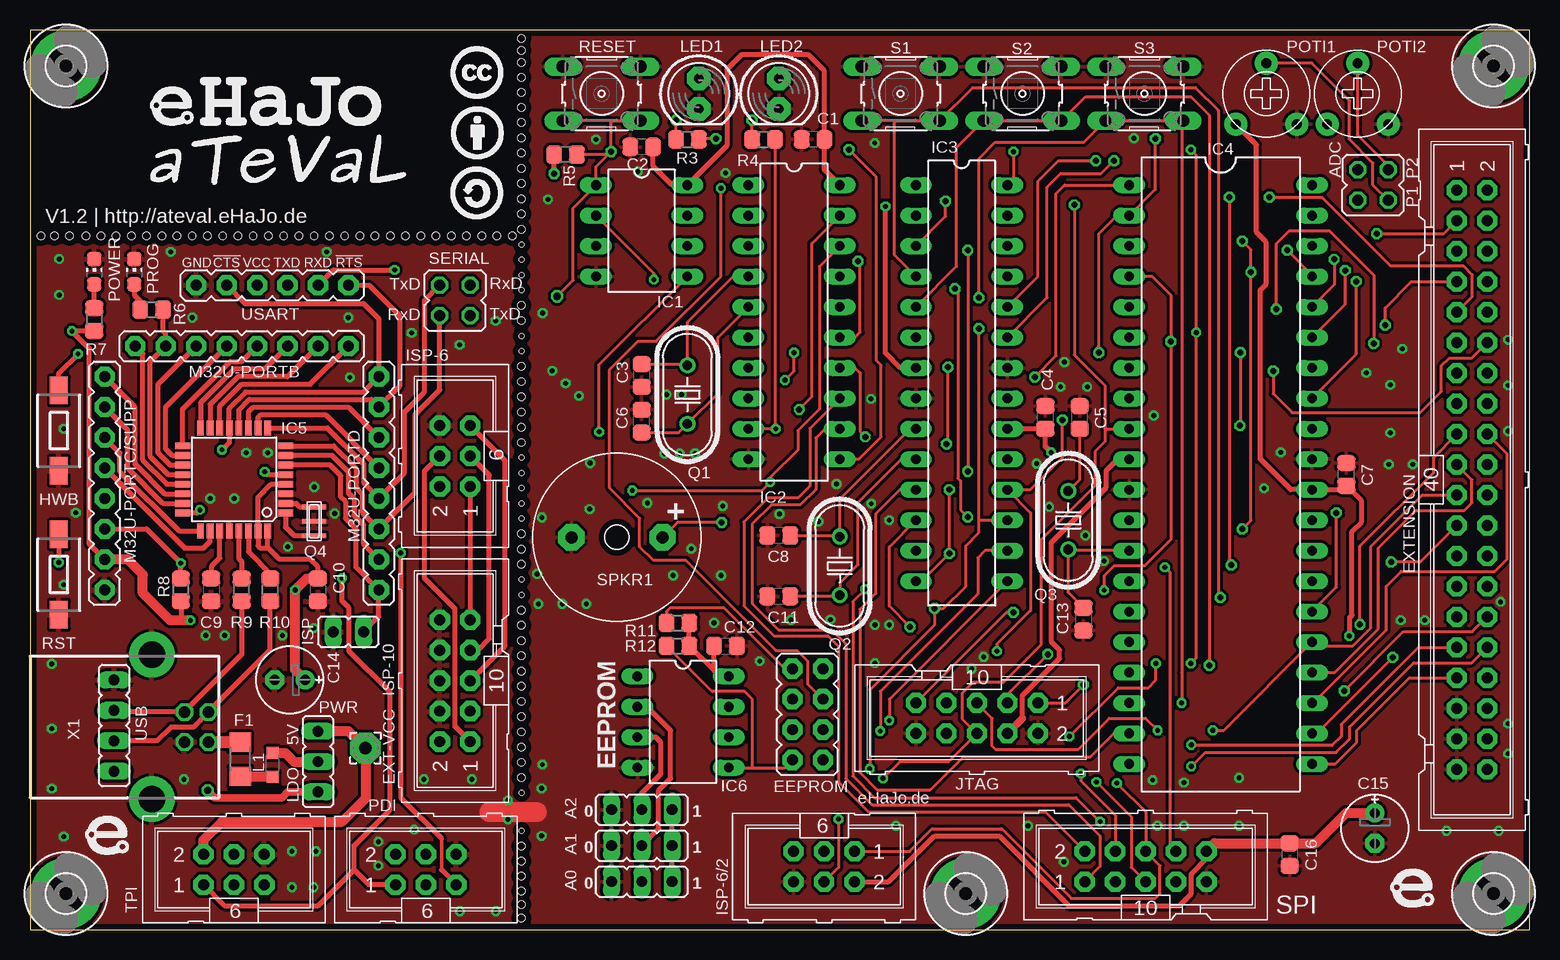
[diagram p6: board, top side]
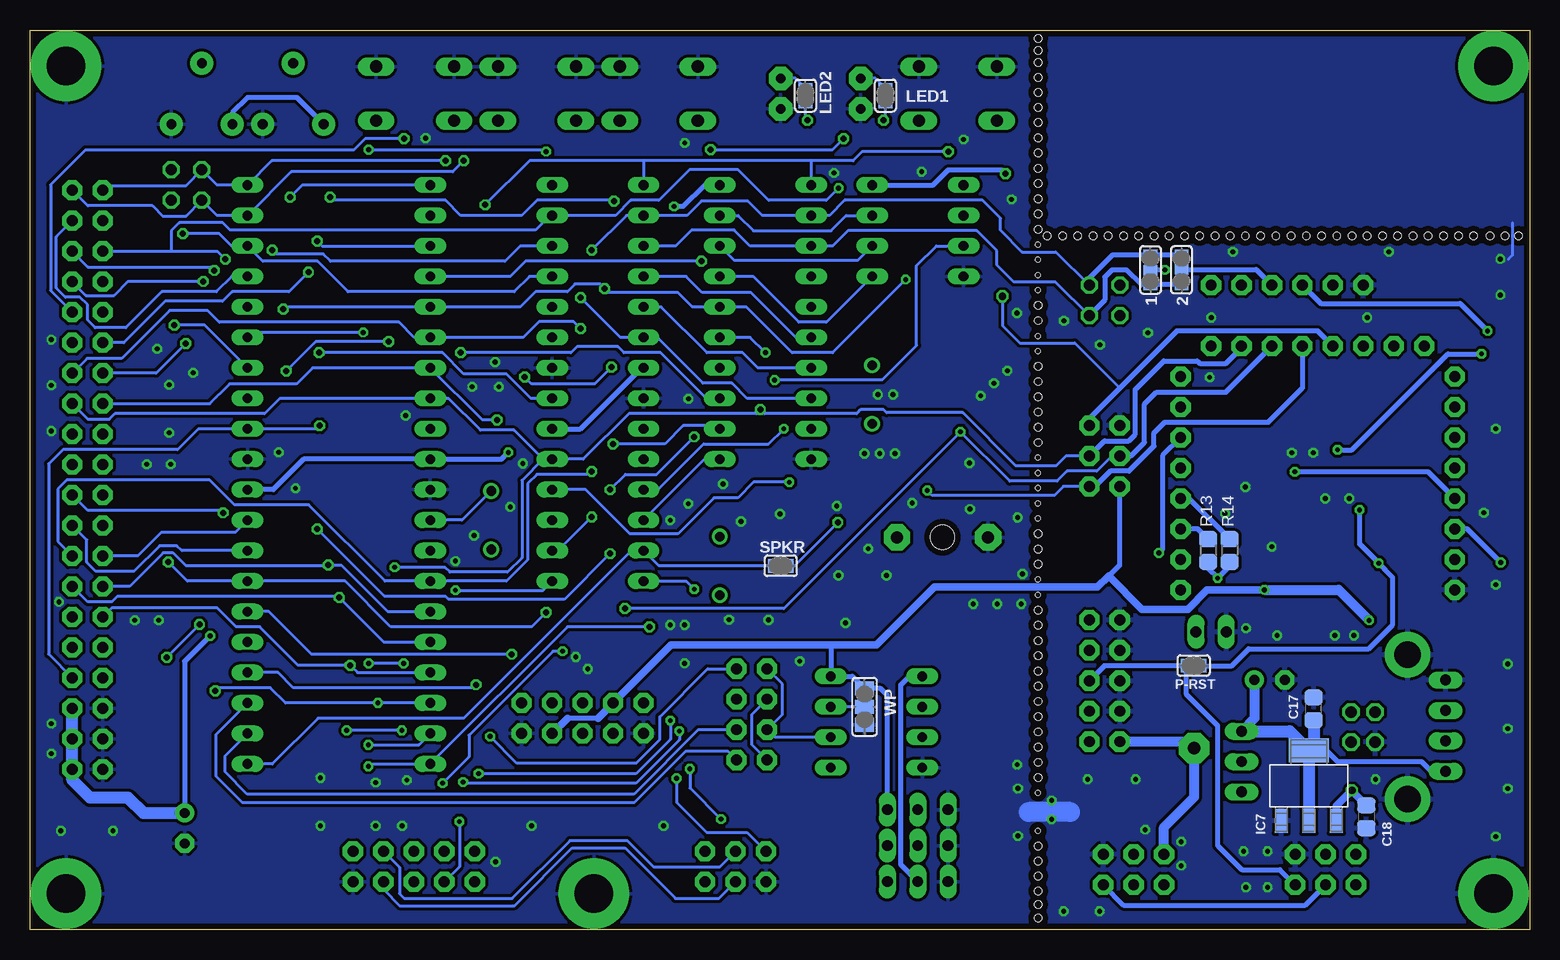
[diagram p7: board, bottom side, seen from below]

Size 125 x 75 mm. Coordinates in mm from the lower left corner, seen from the top.
Outline: 0,0 125,0 125,75 0,75 0,0
Copper layers (1*16): Top 0.035mm / dielectric 1.5mm / Bottom 0.035mm
Design rules "default *": minimum track width 6mil, minimum drill 0.4mm, track to track 6mil, track to pad 6mil, pad to pad 6mil, via to via 6mil, smd to smd 6mil, copper to edge 20mil, drill to drill 8mil, minimum pad ring 10mil, minimum via ring 8mil, stop-mask expansion 4mil, vias tented up to drill 0mil, thermal gap 10mil
Holes 0.6 mm at 40.97,6.95 40.97,12.67 40.97,13.94 40.97,15.21 40.97,16.48 40.97,17.75 40.97,19.02 40.97,20.29 40.97,21.56 40.97,22.83 40.97,24.1 40.97,25.37 40.97,26.64 40.97,30.45 40.97,31.72 40.97,32.99 40.97,40.61 40.97,41.88 40.97,43.15 40.97,44.42 40.97,45.69 40.97,46.96 40.97,50.77 40.97,52.04 40.97,58.39 40.97,59.66 40.97,60.93 40.97,62.2 40.97,63.47 40.97,64.74 40.97,66.01 40.97,67.28 40.97,68.55 40.2,57.85 38.92,57.85 37.66,57.85 36.38,57.85 35.12,57.85 33.84,57.85 32.58,57.85 31.3,57.85 30.04,57.85 28.77,57.85 27.5,57.85 26.23,57.85 24.95,57.85 23.68,57.85 22.41,57.85 21.14,57.85 19.88,57.85 18.61,57.85 17.34,57.85 16.07,57.85 14.79,57.85 13.53,57.85 12.26,57.85 10.98,57.85 9.71,57.85 8.45,57.85 7.17,57.85 5.91,57.85 40.97,69.8 40.97,71.05 40.97,72.3 40.97,73.3 40.97,74.3 40.97,5.7 40.97,4.45 40.97,3.2 40.97,2.08 40.97,0.95 4.66,57.85 3.28,57.85 0.91,57.85 2.03,57.85
Holes 0.4 mm at 40.97,8.22 40.97,11.4 40.97,27.91 40.97,29.18 40.97,34.26 40.97,35.53 40.97,36.8 40.97,38.07 40.97,39.34 40.97,48.23 40.97,49.5 40.97,53.31 40.97,54.58 40.97,55.85 40.97,57.12
Holes 2 mm at 48.93,32.7

### Footprints (pad centres in the part's own frame; a part is rotated, then mirrored left to right if it is on the bottom)
SJ2-S = smd 0.889 x 1.143: 1 -1.238,0; 2 1.238,0; M 0.032,0
JP2 = drill 0.914 long: 1 -2.54,0; 2 0,0; 3 2.54,0
JP2Q = drill 0.914 octagon: 1 -1.27,-1.27; 2 -1.27,1.27; 3 1.27,-1.27; 4 1.27,1.27
C0805 = smd 1.3 x 1.5: 1 -0.95,0; 2 0.95,0
E2,5-6E = drill 0.813 pad 1.575: + -1.27,0 | drill 0.813 pad 1.575 octagon: - 1.27,0
JP4Q = drill 0.914 pad 1.676 octagon: 1 -3.81,-1.27; 2 -3.81,1.27; 3 -1.27,-1.27; 4 -1.27,1.27; 5 1.27,-1.27; 6 1.27,1.27; 7 3.81,-1.27; 8 3.81,1.27
2,54/1,0 = drill 1.016 pad 2.54 octagon: 1 0,0
ML40 = drill 0.914 pad 1.676 octagon: 1 -24.13,-1.27; 2 -24.13,1.27; 3 -21.59,-1.27; 4 -21.59,1.27; 5 -19.05,-1.27; 6 -19.05,1.27; 7 -16.51,-1.27; 8 -16.51,1.27; 9 -13.97,-1.27; 10 -13.97,1.27; 11 -11.43,-1.27; 12 -11.43,1.27; 13 -8.89,-1.27; 14 -8.89,1.27; 15 -6.35,-1.27; 16 -6.35,1.27; 17 -3.81,-1.27; 18 -3.81,1.27; 19 -1.27,-1.27; 20 -1.27,1.27; 21 1.27,-1.27; 22 1.27,1.27; 23 3.81,-1.27; 24 3.81,1.27; 25 6.35,-1.27; 26 6.35,1.27; 27 8.89,-1.27; 28 8.89,1.27; 29 11.43,-1.27; 30 11.43,1.27; 31 13.97,-1.27; 32 13.97,1.27; 33 16.51,-1.27; 34 16.51,1.27; 35 19.05,-1.27; 36 19.05,1.27; 37 21.59,-1.27; 38 21.59,1.27; 39 24.13,-1.27; 40 24.13,1.27
1206 = smd 1.6 x 1.803: 1 -1.422,0; 2 1.422,0
3,2-PAD = drill 3.2 pad 5.842: B3,2 0,0
WS-TRS-6,0X3,5 = smd 2.3 x 1.5: 1 -3.35,0; 2 3.35,0
DIL08 = drill 0.813 long: 1 -3.81,-3.81; 2 -1.27,-3.81; 3 1.27,-3.81; 4 3.81,-3.81; 5 3.81,3.81; 6 1.27,3.81; 7 -1.27,3.81; 8 -3.81,3.81
DIL20 = drill 0.813 long: 1 -11.43,-3.81; 2 -8.89,-3.81; 3 -6.35,-3.81; 4 -3.81,-3.81; 5 -1.27,-3.81; 6 1.27,-3.81; 7 3.81,-3.81; 8 6.35,-3.81; 9 8.89,-3.81; 10 11.43,-3.81; 11 11.43,3.81; 12 8.89,3.81; 13 6.35,3.81; 14 3.81,3.81; 15 1.27,3.81; 16 -1.27,3.81; 17 -3.81,3.81; 18 -6.35,3.81; 19 -8.89,3.81; 20 -11.43,3.81
DIL28-3 = drill 0.813 long: 1 -16.51,-3.81; 2 -13.97,-3.81; 3 -11.43,-3.81; 4 -8.89,-3.81; 5 -6.35,-3.81; 6 -3.81,-3.81; 7 -1.27,-3.81; 8 1.27,-3.81; 9 3.81,-3.81; 10 6.35,-3.81; 11 8.89,-3.81; 12 11.43,-3.81; 13 13.97,-3.81; 14 16.51,-3.81; 15 16.51,3.81; 16 13.97,3.81; 17 11.43,3.81; 18 8.89,3.81; 19 6.35,3.81; 20 3.81,3.81; 21 1.27,3.81; 22 -1.27,3.81; 23 -3.81,3.81; 24 -6.35,3.81; 25 -8.89,3.81; 26 -11.43,3.81; 27 -13.97,3.81; 28 -16.51,3.81
DIL40 = drill 0.813 long: 1 -24.13,-7.62; 2 -21.59,-7.62; 3 -19.05,-7.62; 4 -16.51,-7.62; 5 -13.97,-7.62; 6 -11.43,-7.62; 7 -8.89,-7.62; 8 -6.35,-7.62; 9 -3.81,-7.62; 10 -1.27,-7.62; 11 1.27,-7.62; 12 3.81,-7.62; 13 6.35,-7.62; 14 8.89,-7.62; 15 11.43,-7.62; 16 13.97,-7.62; 17 16.51,-7.62; 18 19.05,-7.62; 19 21.59,-7.62; 20 24.13,-7.62; 21 24.13,7.62; 22 21.59,7.62; 23 19.05,7.62; 24 16.51,7.62; 25 13.97,7.62; 26 11.43,7.62; 27 8.89,7.62; 28 6.35,7.62; 29 3.81,7.62; 30 1.27,7.62; 31 -1.27,7.62; 32 -3.81,7.62; 33 -6.35,7.62; 34 -8.89,7.62; 35 -11.43,7.62; 36 -13.97,7.62; 37 -16.51,7.62; 38 -19.05,7.62; 39 -21.59,7.62; 40 -24.13,7.62
TQFP32-08 = smd 1.27 x 0.559: 1 -4.293,2.8; 2 -4.293,2; 3 -4.293,1.2; 4 -4.293,0.4; 5 -4.293,-0.4; 6 -4.293,-1.2; 7 -4.293,-2; 8 -4.293,-2.8; 17 4.293,-2.8; 18 4.293,-2; 19 4.293,-1.2; 20 4.293,-0.4; 21 4.293,0.4; 22 4.293,1.2; 23 4.293,2; 24 4.293,2.8 | smd 0.559 x 1.27: 9 -2.8,-4.293; 10 -2,-4.293; 11 -1.2,-4.293; 12 -0.4,-4.293; 13 0.4,-4.293; 14 1.2,-4.293; 15 2,-4.293; 16 2.8,-4.293; 25 2.8,4.293; 26 2,4.293; 27 1.2,4.293; 28 0.4,4.293; 29 -0.4,4.293; 30 -1.2,4.293; 31 -2,4.293; 32 -2.8,4.293
SOT-223-4 = smd 1.1 x 2: 1 -2.3,-2.95; 2 0,-2.95; 3 2.3,-2.95 | smd 3.3 x 2: 4 0,2.95
JP1 = drill 0.914 long: 1 0,-1.27; 2 0,1.27
ML6 = drill 0.914 pad 1.676 octagon: 1 -2.54,-1.27; 2 -2.54,1.27; 3 0,-1.27; 4 0,1.27; 5 2.54,-1.27; 6 2.54,1.27
ML10 = drill 0.914 pad 1.676 octagon: 1 -5.08,-1.27; 2 -5.08,1.27; 3 -2.54,-1.27; 4 -2.54,1.27; 5 0,-1.27; 6 0,1.27; 7 2.54,-1.27; 8 2.54,1.27; 9 5.08,-1.27; 10 5.08,1.27
L2012C = smd 1 x 1: 1 -1,0; 2 1,0
LED5MM = drill 0.813 pad 1.93 octagon: A -1.27,0; K 1.27,0
JP8E = drill 0.914 pad 1.676 octagon: 1 0,0; 2 2.54,0; 3 5.08,0; 4 7.62,0; 5 10.16,0; 6 12.7,0; 7 15.24,0; 8 17.78,0
SJS = smd 0.889 x 1.143: 1 -0.603,0; 2 0.603,0
PT-6 = drill 0.8 pad 1.93: A 2.54,-2.54; E -2.54,-2.54; S 0,2.54
CHIP-LED0805 = smd 1.2 x 1.2: A 0,-1.05; C 0,1.05
HC49U70 = drill 0.813: 1 -2.44,0; 2 2.44,0
SMALL-CAP = smd 0.4 x 2: 1 -1.2,0; 2 0,0; 3 1.2,0
R0805 = smd 1.3 x 1.5: 1 -0.95,0; 2 0.95,0
B3F-10XX = drill 1.016 long: 1 -3.251,2.261; 2 3.251,2.261; 3 -3.251,-2.261; 4 3.251,-2.261
SUMMER = drill 1 pad 2.184 octagon: + -3.8,0; - 3.8,0
JP6E = drill 0.914 pad 1.676 octagon: 1 0,0; 2 2.54,0; 3 5.08,0; 4 7.62,0; 5 10.16,0; 6 12.7,0
JP4 = drill 0.914 long: 1 -3.81,0; 2 -1.27,0; 3 1.27,0; 4 3.81,0
SJ_2 = smd 1.168 x 1.6: 1 -1.524,0; 2 0,0; 3 1.524,0
PN61729-S = drill 0.95 octagon: D+ -1.25,2.71; D- -1.25,4.71; GND 1.25,2.71; VCC 1.25,4.71 | drill 2.2 pad 3.81: S1 -6.02,0; S2 6.02,0

### Placement (x,y rotation side)
1  31.6,55 270 bottom
2  29,55 90 bottom
A0  51,4 180 top
A1  51,7 180 top
A2  51,10 180 top
ADC  111.95,62.07 270 top
C1  65.28,65.88 180 top
C2  50.99,65.25 180 top
C3  50.99,46.2 270 top
C4  84.64,42.7 90 top
C5  87.5,42.7 90 top
C6  50.99,42.38 90 top
C7  109.73,37.94 90 top
C8  62.42,32.86 180 top
C9  15.11,28.32 270 top
C10  24,28.32 270 top
C11  62.42,27.78 180 top
C12  57.98,23.65 0 top
C13  87.82,25.88 270 top
C14  21.66,20.82 180 top
C15  112.11,8.45 270 top
C16  105,6.25 270 top
C17  18,18.4 90 bottom
C18  13.6,9.4 270 bottom
EEPROM  64.83,17.94 90 top
EXT-VCC  27.96,15.13 0 top
EXTENSION  120.2,37.5 270 top
F1  17.53,14.21 270 top
H1  3,3 0 top
H2  3,72 0 top
H3  122,3 0 top
H4  122,72 0 top
H5  78,3 0 top
HWB  2.4,41.6 90 top
IC1  50.99,58.26 270 top
IC2  63.69,50.64 270 top
IC3  77.66,45.56 270 top
IC4  99.25,37.94 270 top
IC5  17.02,37.53 180 top
IC6  54.44,17.3 270 top
IC7  18.4,12 0 bottom
ISP  26.54,24.83 90 top
ISP-6  35.43,39.48 90 top
ISP-6/2  66.2,5.25 180 top
ISP-10  35.43,20.75 90 top
JTAG  78.93,17.62 180 top
L1  20.21,13.71 90 top
LED1  55.75,69.69 270 top
LED2  62.42,69.69 270 top
M32U-PORTB  26.54,48.64 180 top
M32U-PORTC/SUPP  6.22,28.32 90 top
M32U-PORTD  29.08,28.32 90 top
P-RST  28,22 180 bottom
PDI  33,5 0 top
POTI1  103.06,69.69 0 top
POTI2  110.68,69.69 0 top
POWER  5.36,54.84 0 top
PROG  8.69,54.84 0 top
PWR  24,14 90 top
Q1  54.8,44.61 90 top
Q2  67.5,30.32 90 top
Q3  86.55,34.13 90 top
Q4  23.68,34.03 90 top
R3  54.8,65.88 0 top
R4  61.15,65.88 0 top
R5  44.64,64.61 180 top
R6  10.14,51.69 0 top
R7  5.36,50.85 270 top
R8  12.57,28.32 270 top
R9  17.65,28.32 90 top
R10  20.03,28.32 90 top
R11  54.01,25.56 0 top
R12  54.01,23.65 0 top
R13  26.8,31.6 270 bottom
R14  25,31.6 270 bottom
RESET  47.66,69.69 0 top
RST  2.4,29.6 90 top
S1  72.58,69.69 0 top
S2  82.74,69.69 0 top
S3  92.9,69.69 0 top
SERIAL  35.43,52.45 90 top
SJ2  53.69,69.53 270 bottom
SJ3  60.36,69.53 270 bottom
SJ4  62.42,30.32 180 bottom
SPI  93,5.25 0 top
SPKR1  48.93,32.7 180 top
TPI  17,5 0 top
USART  13.84,53.72 0 top
USB  7,17 90 top
WP  55.44,18.57 270 bottom
X1  10.16,16.89 270 top

### Tracks (layer width: path | path; a pad name or v marks a point on that pad's centre or on a via)
!CTS  (via drill 0.4)
  Top 0.406: v16,40 16.62,40.62 IC5.13 16.62,43.48 17.97,44.83 27.81,44.83 M32U-PORTD.8 29.08,50.92 27.8,52.2 17.9,52.2 USART.2 | HWB.2 2.4,46.4 v4,48
  Bottom 0.406: v16,40 14.8,40 6.8,48 v4,48
!RESET  (via drill 0.4, 0.5, 0.6)
  Top 0.254: 89.6,41.75 89.6,40.67 88.77,39.84 88.77,36.99 84.26,32.48 84.26,23.72 81.14,20.59 78.59,20.59 77.7,19.7 77.7,17.58 JTAG.6 76.58,14 72.5,14 v71.1,12.6 | 89.6,41.75 89.6,45.37 87.06,47.91 v87.06,60.42 | 48.45,67.43 RESET.3 | 48.45,67.43 RESET.4 | 89.6,41.75 IC4.9 | v48.45,64.86 47.18,63.59 IC1.1 45.27,60.16 45.27,54.13 v43.94,52.79 | R5.1 48.2,64.61 v48.45,64.86 | v48.45,64.86 48.45,67.43
  Top 0.406: IC5.18 11.84,39.53 11.3,40.07 11.3,43.56 M32U-PORTB.5 | ISP-10.5 39.56,23.61 39.56,39.16 ISP-6.5
  Bottom 0.254: 59.88,64.1 IC2.1 | 59.88,64.1 56.39,64.1 55.63,64.86 v48.45,64.86 | v87.06,60.42 83.38,64.1 73.85,64.1 | 59.88,64.1 73.85,64.1 | 73.85,64.1 IC3.1 | v43.94,52.79 43.94,50.34 42.5,48.9 37.9,48.9 34.16,45.16 | v71.1,12.6 71.1,10.6 68.6,8.1 65.24,8.1 ISP-6/2.5
  Bottom 0.406: M32U-PORTB.5 17.65,49.91 29.4,49.91 34.16,45.16 36.7,42.61 ISP-6.5 | ISP-10.5 35.45,22 P-RST.2 28.6,19.6 26,17 26,7 24,5 20.81,5 TPI.5
!RTS
  Top 0.406: IC5.12 17.42,43.33 18.29,44.2 28.45,44.2 M32U-PORTD.7 30.8,45.28 30.8,51.2 28.28,53.72 USART.6
+5V  (via drill 0.4, 0.5)
  Top 0.406: IC5.4 20.11,37.13 19.02,36.03 IC5.31 19.02,31.98 19.2,31.8 19.75,31.8 19.82,31.87 | 19.82,31.87 IC5.32 | 19.82,31.87 20.83,30.86 23.37,30.86 24,30.23 C10.1 | M32U-PORTC/SUPP.2 4.95,32.13 4.95,48.45 v3.5,49.91 R7.2 | v71.31,60.29 71.31,48.1 72.58,46.83 IC3.7 | IC2.20 66.23,63.34 C1.1 66.23,71.6 64.9,72.93 59.31,72.93 58.1,71.72 58.1,65.37 IC1.8 53.53,62.07 51.94,63.66 C2.1 | 82.74,17.62 82.74,19.52 85.81,22.6 85.81,23.3 85.15,23.96 85.15,32.29 89.72,36.86 89.72,38.26 90.68,39.21 IC4.10 | v43.69,63.02 R5.2 | 57.02,21.58 R12.2 R11.2 | v109.98,24.48 109.98,25.98 110.2,26.2 110.2,33.2 111,34 111,35.72 C7.1 109.41,36.67 IC4.30 105.09,36.67 102.55,39.21 102.55,53.31 103.06,53.81 103.06,57.31 102.23,58.13 102.23,65.44 POTI1.E | IC3.20 C4.1 84.64,40.26 v85.13,39.78 | 57.02,21.58 C12.1 | 57.02,21.58 57.5,21.11 IC6.8 | R11.2 | R8.2 12.6,27.34 12.6,25.78 | ISP-6/2.2 71.58,3.98 75.4,7.8 80.8,7.8 86.6,2 95.8,2 96.8,3 96.8,4.6 98.08,5.88 SPI.10 | A0.1 A1.1 A2.1
  Top 0.61: JTAG.4 82.74,17.62
  Top 0.813: v13.37,25.78 12.6,25.78 11.67,25.78 9.4,28.05 9.4,29.59 8.13,30.86 M32U-PORTC/SUPP.2 | C10.1 23.05,29.27 v22.1,28.32 22.1,21.65 C14.+ | SPI.10 98.76,7.2 C16.1 107.2,7.2 109.72,9.71 C15.+ | PWR.3 26.55,16.54 EXT-VCC.1 28,15.09 28,11 26,9 16,9 14.46,7.46 TPI.2
  Bottom 0.406: IC4.30 104.73,36.67 102.19,39.21 IC4.10 85.7,39.21 v85.13,39.78 | IC3.7 74.03,46.83 79.11,41.75 IC3.20 | 77.66,17.62 80.2,17.62 | POTI1.E 102.74,69.37 106.87,69.37 108.14,68.1 POTI2.E | IC1.8 49.72,62.07 48.45,63.34 44.01,63.34 v43.69,63.02 | 58.24,23.72 IC6.8 56.45,21.11 WP.1 54.1,20.1 53.54,19.54 A2.1 | v71.31,60.29 70.55,60.29 68.77,62.07 IC2.20 | v109.98,24.48 v109.98,24.49 112.11,22.36 C15.+ | ISP-6.2 34.16,30.38 35.07,29.47 | USART.3 17.4,52.2 5.79,52.2 v3.5,49.91 | USB.1 8.19,13.19 9,14 16,14 17,15 18.35,15 IC7.4
  Bottom 0.61: 80.2,17.62 JTAG.4 | 77.66,17.62 JTAG.7 71.56,23.72 58.24,23.72 54.42,23.72 49.59,28.54 36,28.54 35.07,29.47 32.3,26.7 28.5,26.7 26.88,28.32 v22.1,28.32
  Bottom 0.813: v22.1,28.32 15.91,28.32 v13.37,25.78 | ISP-10.2 28.49,15.67 EXT-VCC.1 27.96,11.04 30.46,8.54 PDI.2 | C14.+ 22.93,17.61 PWR.3
  Bottom 1.016: EXTENSION.36 EXTENSION.38 EXTENSION.40 121.47,12.47 120,11 116.82,11 115.54,9.71 C15.+ | IC7.4 IC7.2 | PWR.3 19.99,16.54 IC7.4 | C17.1 18,15.35 IC7.4
A0
  Bottom 0.406: A0.2 52.4,5.4 52.4,20.4 51.69,21.11 IC6.1
AREF  (via drill 0.5)
  Top 0.254: v100.87,42 100.9,42.04 v100.9,48.1
  Bottom 0.254: v100.9,48.1 90.61,48.1 88.84,46.32 85.28,46.32 83.25,44.29 IC3.21 | EXTENSION.34 123.44,22.96 123.44,38.81 122.24,40.02 112.7,40.02 110.97,41.75 IC4.32 101.12,41.75 v100.87,42
CLOCK  (via drill 0.4)
  Top 0.305: 34.3,7.6 34.3,4.97
  Top 0.406: IC5.11 18.22,43.17 18.61,43.56 26.54,43.56 M32U-PORTD.6 | v30.9,31.4 30.9,11 34.3,7.6 | 34.3,4.97 PDI.5
  Bottom 0.406: TPI.3 18.73,2 33.81,2 PDI.5 | M32U-PORTD.6 30.6,39.5 30.6,31.7 v30.9,31.4
CS1  (via drill 0.5)
  Top 0.254: v76.4,40.48 76.53,40.61 v76.53,46.89 | v83.76,46.07 85.53,47.85 85.53,61.37 86.23,62.07 IC4.1 | v103.31,61.05 107.69,61.05 113.43,55.32 119.51,55.32 120.2,54.62 120.2,52.74 EXTENSION.9 | IC2.12 66.25,41.75 65.5,41 65.5,36.7 64.2,35.4 61.8,35.4 60.2,33.8 60.2,27.2 62.4,25 66.8,25 68,23.8 68,12.6 70.2,10.4 86.6,10.4 89.2,7.8 89.2,5.26 SPI.1
  Bottom 0.254: v76.4,40.48 72.07,40.48 70.55,42 67.75,42 IC2.12 | v76.53,46.89 77.92,45.5 83.18,45.5 v83.76,46.07 | v103.31,61.05 102.3,62.07 IC4.1
CS2  (via drill 0.5)
  Top 0.254: v89.09,48.1 89.09,58.01 90.61,59.53 IC4.2 93.82,61.72 v93.82,65.94 | IC2.13 65,41.79 65,37 64,36 61.5,36 59.5,34 59.5,27 62,24.5 66.5,24.5 67.4,23.6 67.4,12.3 69.9,9.8 84.64,9.8 SPI.2
  Bottom 0.254: IC2.13 68.62,44.29 72.43,48.1 75.5,48.1 76,48.6 79.4,48.6 79.9,48.1 v89.09,48.1 | v93.82,65.94 97.06,65.94 98,65 120.39,65 123.28,62.1 123.28,53.28 EXTENSION.10
CS3  (via drill 0.4, 0.5)
  Top 0.254: v76.64,36.67 v76.64,31.34 74.36,29.05 IC3.14 | v101.06,33.38 101.79,34.11 v101.79,54.8 101.79,56.67 v101.06,57.4 | IC2.14 68.77,46.83 69.2,46.4 69.2,41.51 v69.63,41.08 | v69.62,28.38 68.6,27.35 68.6,12.8 70.4,11 87.2,11 v89.2,9
  Bottom 0.254: v76.64,31.34 80.45,27.53 90.11,27.53 90.36,27.78 95.46,27.78 v101.06,33.38 | v101.06,57.4 100.65,56.99 IC4.3 | v69.63,41.08 72.77,37.94 75.37,37.94 v76.64,36.67 | v101.79,54.8 103.41,53.18 108.14,53.18 108.94,52.38 113.73,52.38 117.18,48.93 EXTENSION.11 | IC3.14 70.3,29.05 v69.62,28.38 | v89.2,9 89.2,5.24 SPI.3
CS4  (via drill 0.4, 0.5)
  Top 0.254: IC2.15 68.77,49.37 69.2,49.8 69.2,55.55 v69.03,55.72 | v62.93,45.81 63.69,46.58 v63.69,48.1 | v103.63,46.58 103.63,44.67 105.22,43.08 115.89,43.08 117.67,44.86 117.67,47.01 118.3,47.64 120.19,47.64 EXTENSION.12 | v89.53,28.29 89.53,29.49 90.36,30.32 92.9,30.32 95.09,32.51 v95.09,49.02 95.09,52.91 93.55,54.45 IC4.4 | IC3.15 71.62,19.2 v71.62,17.43 | v87.6,13 87.6,12.4 90.46,9.54 SPI.4
  Bottom 0.254: v69.03,55.72 83.69,55.72 84.96,54.45 IC4.4 | v103.63,46.58 101.19,49.02 v95.09,49.02 | v62.93,45.81 53.97,45.81 51.09,48.7 51.09,55.35 49.45,56.99 IC1.3 | v89.53,28.29 82.23,28.29 IC3.15 | v63.69,48.1 64.96,49.37 IC2.15 | v71.62,17.43 71.62,15.88 74.5,13 v87.6,13
D+
  Top 0.406: R9.1 17.65,22.92 X1.D+ 7.13,18.14 USB.3
D-
  Top 0.406: R10.1 20.03,23.3 X1.D- 13.61,16.88 11.75,16.88 10.61,15.73 USB.2
DATA  (via drill 0.4)
  Top 0.406: PDI.1 28.27,3.73 27,5 | TPI.1 16.19,2 24,2 27,5 | v26,29.3 26,27.4 26.6,26.8 26.6,23.2 30,19.8 30,10 27,7 27,5
  Bottom 0.406: R13.2 26.8,30.1 v26,29.3 25,30.3 R14.2
EXTENSION-1  (via drill 0.5)
  Top 0.254: IC3.23 84.77,52.67 84.77,61.88 85.92,63.02 89.28,63.02 v90.36,64.1
  Bottom 0.254: v90.36,64.1 104.84,64.1 IC4.40 109.41,62.07 ADC.1 112.02,62 118.56,62 EXTENSION.1
EXTENSION-2  (via drill 0.5)
  Top 0.254: v88.84,64.1 85.72,64.1 84.01,62.39 84.01,54.45 IC3.24
  Bottom 0.254: v88.84,64.1 89.76,63.18 103.22,63.18 IC4.39 109.41,59.53 ADC.3 111.98,59.5 113.94,59.5 114.78,60.34 120.19,60.34 EXTENSION.2
EXTENSION-3  (via drill 0.5)
  Top 0.254: v112.27,58.01 117.85,58.01 EXTENSION.3
  Bottom 0.254: v112.27,58.01 109.22,58.01 108.2,56.99 IC4.38 105.6,55.72 101.03,55.72 98.49,53.18 84.64,53.18 83.38,54.45 IC3.25
EXTENSION-4  (via drill 0.5)
  Top 0.254: IC4.37 106.87,54.58 v104.81,56.64
  Bottom 0.254: IC3.26 84.14,56.99 85.41,55.72 99.95,55.72 100.55,56.32 104.49,56.32 v104.81,56.64 | EXTENSION.4 122.81,57.76 122.81,53.48 122.04,52.72 120.84,52.72 120.2,52.09 120.2,50.81 119.57,50.18 117.02,50.18 114.02,53.18 109.47,53.18 108.2,54.45 IC4.37
EXTENSION-5  (via drill 0.4, 0.5)
  Top 0.254: v57.59,61.82 57.59,54.45 52.2,49.05 50.67,49.05 48.32,46.7 48.32,36.8 50.83,34.29 50.83,31.91 51.94,30.8 54.65,30.8 62.18,23.27 63.94,23.27 64.83,22.38 64.83,20.48 EEPROM.5 | v108.71,55.88 108.71,53.75 IC4.36
  Bottom 0.254: v57.59,61.82 58.61,60.8 63.44,60.8 65.98,63.34 70.04,63.34 72.58,60.8 74.93,60.8 76.2,59.53 IC3.27 81.66,59.53 82.87,58.32 108.33,58.32 108.93,58.93 112.55,58.93 113.22,58.26 113.22,56.57 113.2,56.55 | EXTENSION.5 113.2,56.55 | 113.2,56.55 109.38,56.55 v108.71,55.88
EXTENSION-6  (via drill 0.4, 0.5)
  Top 0.254: v81.98,64.86 81.98,62.58 IC3.28 | v96.77,22.19 97.22,22.64 v97.22,49.78 97.22,64.58 v96.77,65.02 | v109.63,54.96 109.63,52.13 IC4.35 | v86.64,16.1 90.71,20.16 93.22,20.16 93.85,20.79 v93.85,22.19
  Bottom 0.254: v93.85,22.19 v96.77,22.19 | v97.22,49.78 106.46,49.78 IC4.35 | v96.77,65.02 82.14,65.02 v81.98,64.86 | EXTENSION.6 120.17,55.25 109.92,55.25 v109.63,54.96 | EEPROM.7 68.5,21.75 72.5,17.75 72.5,15.84 74.47,13.87 84.42,13.87 v86.64,16.1
EXTENSION-7  (via drill 0.5)
  Top 0.254: v112.97,50.39 112.97,51.83 115.14,54.01 EXTENSION.7
  Bottom 0.254: v112.97,50.39 110.43,50.39 IC4.34
EXTENSION-8  (via drill 0.5)
  Top 0.254: v110.55,54.04 110.55,47.97 IC4.33
  Bottom 0.254: EXTENSION.8 120.34,52.88 118,52.88 116.84,54.04 v110.55,54.04
EXTENSION-17  (via drill 0.5)
  Top 0.254: v110.87,25.43 110.87,31.97 117,38.1 117,39.38 EXTENSION.17 | v113.6,22.7 107.25,16.35 IC4.22
  Bottom 0.254: v113.6,22.7 v110.87,25.43 | EEPROM.3 69.28,16.67 74.66,11.29 106.89,11.29 108.75,13.15 108.75,14.47 IC4.22
EXTENSION-18
  Top 0.254: EXTENSION.18 123.13,39.66 123.13,30.88 122.11,29.86 114.3,29.86 113.06,28.62 113.06,24.97 106.98,18.89 IC4.23
  Bottom 0.254: EEPROM.1 66.84,14.88 70.32,14.88 74.61,10.59 107.3,10.59 109.5,12.79 109.5,16.26 IC4.23
EXTENSION-19  (via drill 0.5)
  Top 0.254: IC4.24 108.76,21.43 112.39,25.07 112.39,31.8 115.54,34.94 119.57,34.94 120.2,35.58 120.2,37.5 EXTENSION.19 | JTAG.1 86.3,18.89 v87.82,20.41
  Bottom 0.254: IC4.24 104.33,21.43 103.06,20.16 88.07,20.16 v87.82,20.41
EXTENSION-21  (via drill 0.4)
  Top 0.254: EXTENSION.21 116.07,36.23 111.79,31.95 111.79,25.16 110.28,23.65 107.19,23.65 IC4.25 99.5,16.6 v98.6,16.6 | v94,16.6 92.98,17.62 89.98,17.62 87.38,15.02 80.49,15.02 80.2,15.3 80.2,17.62 JTAG.5
  Bottom 0.254: v94,16.6 v98.6,16.6
EXTENSION-22  (via drill 0.5)
  Top 0.254: v108.9,34.75 108.9,28.54 IC4.26 | v84.83,22.95 81.47,19.59 JTAG.3
  Bottom 0.254: v84.83,22.95 101.54,22.95 105.09,26.51 IC4.26 | EXTENSION.22 120.19,34.94 109.1,34.94 v108.9,34.75
EXTENSION-23  (via drill 0.5)
  Top 0.254: JTAG.9 81.41,26.45 v81.98,26.45 | EXTENSION.23 115.88,30.64 v113.47,30.64
  Bottom 0.254: v81.98,26.45 83.18,25.24 94.92,25.24 98.73,29.05 IC4.27 111.89,29.05 v113.47,30.64
EXTENSION-24
  Bottom 0.254: IC4.28 112.34,31.59 112.75,32 114.2,32 116.34,29.86 119.51,29.86 120.27,30.62 120.27,32.48 EXTENSION.24
EXTENSION-25
  Bottom 0.254: EXTENSION.25 116.01,31.15 114.03,33.13 107.87,33.13 IC4.29
EXTENSION-28  (via drill 0.5)
  Top 0.254: 71.94,67.43 S1.4 78.6,70.2 97.15,70.2 99.06,68.29 99.06,27.84 v99.22,27.68 | 71.94,67.43 S1.3 | 71.94,67.43 72.07,67.3 72.07,56.23 IC3.4
  Bottom 0.254: IC2.6 61.15,49.37 64.9,53.12 68.96,53.12 70.29,54.45 IC3.4 | IC4.16 95.5,23.97 v99.22,27.68 99.31,27.78 117.71,27.78 118.17,27.32 120.19,27.32 EXTENSION.28
EXTENSION-29  (via drill 0.5)
  Top 0.254: v98.3,22.03 98.3,67.91 96.77,69.44 88,69.44 S2.4 S2.3 77.25,65.19 77.25,55.31 IC3.5
  Bottom 0.254: IC4.17 97.69,21.43 v98.3,22.03 102.65,22.03 105.85,25.24 107.82,25.24 109.41,26.83 118.18,26.83 EXTENSION.29 | IC2.7 64.33,46.83 65.59,48.1 68.58,48.1 72.39,51.91 IC3.5
EXTENSION-30  (via drill 0.4, 0.5)
  Top 0.254: v79.09,52.67 79.09,64.26 80.45,65.63 87.84,65.63 S3.3 S3.4 96.01,67.29 96.01,21.43 96,21.42 v96,18.89 | EXTENSION.30 120.25,24.84 114.49,24.84 v109.56,19.91
  Bottom 0.254: IC2.8 65.21,44.29 66.48,45.56 68.9,45.56 72.71,49.37 IC3.6 75.79,49.37 v79.09,52.67 | v109.56,19.91 109.3,20.16 104.97,20.16 103.69,18.89 v96,18.89 IC4.18
EXTENSION-31  (via drill 0.4)
  Top 0.254: IC3.11 72.52,36.67 70.48,34.63 70.48,28.01 69.18,26.71 69.18,13.09 70.61,11.65 75.06,11.65 77.8,14.4 88.41,14.4 90.36,16.35 IC4.19 | R4.2 62.17,65.81 v62.17,41.75 IC2.9 | EXTENSION.31 115.73,23.53 109.3,17.1 109.3,16.1 108.53,15.33 96.87,15.33 v96.8,15.4
  Bottom 0.254: IC3.11 72.64,36.67 68.83,40.48 63.44,40.48 v62.17,41.75 | v96.8,15.4 92.58,15.4 IC4.19
EXTENSION-32  (via drill 0.4, 0.5)
  Top 0.254: v68.26,65.02 70.55,62.74 70.55,47.45 70.95,47.05 70.95,41.07 69.09,39.21 IC2.11 | v73.36,25.24 71.63,26.97 71.63,31.91 IC3.12 | 55.82,65.88 R3.2 55.81,65.94 v57.18,65.94 | EXTENSION.32 120.19,22.25 115.35,22.25 110,16.9 110,15.9 108.86,14.76 97.96,14.76 v96.8,13.6
  Bottom 0.254: IC3.12 68.77,39.21 IC2.11 | v73.36,25.24 80.2,25.24 IC4.20 96.59,13.81 v96.8,13.6 | v57.18,65.94 58.1,65.02 v68.26,65.02
EXTENSION-33
  Top 0.254: IC4.21 108.81,13.81 110.6,15.6 110.6,16.6 114.99,20.99 EXTENSION.33
  Bottom 0.254: IC4.21 104.81,13.81 101,17.62 88.84,17.62 74.87,31.59 IC3.13 72.58,30.32 SJ4.2
GND  (via drill 0.4)
  Top 1.676: 38.29,9.81 42.23,9.81
  Bottom 0.254: 1.43,58.91 1.43,56.22 1.76,55.89
  Bottom 1.676: 38.29,9.81 41.73,9.81
  other vias: 23.68,36.89 17.02,35.94 18.02,39.75 21.49,31.91 24.73,56.51 26.53,51.02 26.66,46.04 32.03,8.32 89.54,30.72 96.19,12.25 100.79,12.65 118.08,8.22 122.43,8.22 85.92,45.24 88.14,45.24 79.5,22.73 43.53,46.59 50.67,63.18 47.18,65.88 57.02,25.56 60.83,22.38 42.64,11.76 42.64,7.8 42.72,13.75 39.84,10.76 39.84,9.18 55.12,31.75 51.47,35.56 57.75,35.31 57.61,29.52 63.43,25.82 93.69,42.86 44.64,45.54 45.75,44.5 42.67,34.35 46.64,35.05 46.69,38.9 53.05,44.61 54.32,44.61 52.9,39.69 54.16,39.69 55.44,39.69 67.23,37.15 71.63,34.13 71.63,25.4 87.98,32.86 84.96,35.24 83.91,38.85 86.23,47.31 123.22,49.18 123.22,45.37 123.22,41.56 113.4,41.41 122.59,27.32 123.22,17.16 13.53,51.02 11.73,56.51 2.43,52.91 2.43,55.91 25.39,34.69 62.49,34.64 65.74,34.02 66.74,25.84 70.13,35.51 113.27,38.78 115.27,38.78 104.27,39.78 114.27,25.78 116.27,25.78 123.22,14.66 96.19,8.65 100.79,8.65 42.27,29.65 42.37,27.15 44.37,27.15 46.37,27.15 78.5,21.73 70.43,25.4 102.87,36.78 70.11,44.24 72.19,8.65 83.19,8.65 86.19,5.65 93.99,8.65 93.59,12.45 70.43,22.2 53.61,29.52 111.4,46.41 114.4,48.41 113.4,45.41 92.02,65.98 70.42,65.58 43.18,60.88 57.98,63.08 42.73,51.39 29.04,5.32 23.64,3.52 21.84,3.52 29.04,7.32 21.84,6.52 23.84,6.52 12.84,12.52 32.84,12.52 36.84,12.52 38.84,1.52 35.84,1.52 16.23,24.52 14.63,24.52 23.64,25.12 21.04,24.52 15.02,35.94 19.82,39.75 35.82,48.75 38.82,50.75 31.82,49.75 2.82,41.75 3.82,34.75 2.82,28.75 1.82,22.15 1.82,16.75 1.82,11.75 2.82,7.75
  pour Top (isolate 0.254): -2,75.77 -2,-1 40.83,-1 40.83,75.77
  pour Bottom (isolate 0.254): -1,75.77 -1,-2 40.83,-2 40.83,75.77
  pour Top (isolate 0.254): 41.1,75.77 41.1,-1 125.65,-1 125.65,75.77
  pour Bottom (isolate 0.254): 41.1,-2 126.65,-2 126.65,75.77 41.1,75.77
MISO  (via drill 0.4, 0.5)
  Top 0.254: v86.07,42.48 86.07,39.37 83.38,36.67 IC3.18 83.4,34.74 83.4,26.6 80.6,23.8 v80.6,23.2 | ISP-6/2.1 73.32,6.52 75.2,8.4 81,8.4 86.8,2.6 93.8,2.6 94.2,3 94.2,5.32 SPI.6 93,9.8 v90.6,12.2 | v50.2,36.6 61,36.6 v61.7,37.3 61.7,37.7 64,40 64,41.6 65.8,43.4 65.8,55.29 IC2.18
  Top 0.406: IC5.17 12.72,43.4 16.7,47.37 17.65,47.37 M32U-PORTB.4 | ISP-6.1 ISP-10.9
  Bottom 0.254: v86.07,42.48 87.28,42.48 IC4.7 101.46,46.83 102.79,45.5 108.36,45.5 110.01,43.85 EXTENSION.15 | v80.6,23.2 81.4,23.2 88.4,16.2 88.4,14.4 v90.6,12.2 | IC2.18 66.31,55.8 55.99,55.8 IC1.6 | ISP-6.1 38.86,36.94 39.6,36.2 49.8,36.2 v50.2,36.6 | v61.7,37.3 64.7,37.3 66,36 68,36 71,33 75,33 78.67,36.67 IC3.18
  Bottom 0.406: M32U-PORTB.4 18.92,45.15 21.77,42.3 30.4,42.3 31.3,41.4 31.3,40.3 33.39,38.21 34.96,38.21 36.23,36.94 ISP-6.1
MOSI  (via drill 0.4, 0.5)
  Top 0.254: 79.09,34.13 v79.09,50.1 | 79.09,34.13 IC3.17 | IC1.5 47.43,47.08 v47.43,41.5 47.25,41.31 | 79.09,34.13 79.09,33.09 78,32 78,28.62 76.14,26.76 v75.41,26.76 75.41,25.41 70,20 v70,13.4 | v67.4,9.2 67.4,5.18 ISP-6/2.4
  Top 0.406: IC5.16 14.22,43.94 17.02,46.73 19.56,46.73 M32U-PORTB.3 | ISP-6.4 32.89,38.21 32.89,29.27 35.43,26.73 35.43,16.94 ISP-10.1
  Bottom 0.254: v79.09,50.1 79.69,50.7 82.55,50.7 83.88,49.37 IC4.6 92.96,49.37 94.23,50.64 109.22,50.64 110.2,51.62 113.38,51.62 117.38,47.62 120.24,47.62 EXTENSION.14 | ISP-6.4 34.8,39.48 36.07,38.21 38.56,38.21 39.38,37.39 43.33,37.39 v47.43,41.5 62.17,26.76 v75.41,26.76 | IC1.5 58.61,50.64 60.9,50.64 64.71,54.45 IC2.17 | SPI.7 95.54,3.34 94.2,2 84.6,2 79.8,6.8 75.4,6.8 71.2,2.6 67.58,2.6 ISP-6/2.4 | v70,13.4 70,11.8 v67.4,9.2
  Bottom 0.406: ISP-6.4 33.24,39.48 32.1,40.62 32.1,43.8 31.1,44.8 25.3,44.8 M32U-PORTB.3
N$1
  Top 0.813: L1.2 21.29,14.71 22,14 PWR.2
N$3
  Top 1.016: X1.VCC 14.88,15.63 F1.1
N$4
  Top 0.406: IC5.14 15.82,43.63 17.65,45.47 23.37,45.47 M32U-PORTB.1
N$5
  Top 0.406: IC5.30 18.22,31.48 20.03,29.67 R10.2
N$6
  Top 0.406: IC5.29 17.42,30.91 17.65,30.67 R9.2
N$9
  Top 0.406: IC5.27 15.82,30.98 15.11,30.27 C9.1
N$10
  Top 0.254: IC3.9 73.34,41.75 67.5,35.91 Q2.2 67.4,32.86 C8.1
N$11
  Top 0.406: IC5.19 11.69,38.73 10.67,39.75 10.67,45.47 M32U-PORTB.6
N$12  (via drill 0.6)
  Top 0.61: PWR.1 21.46,11.46 21,11 15.4,11 v14.8,11.6
  Bottom 0.61: IC7.3 16.1,10.3 v14.8,11.6 14.8,11.55 C18.1
N$13
  Top 0.406: IC5.21 11.38,37.13 9.4,39.12 9.4,48.01 M32U-PORTB.8
N$17
  Top 0.406: IC5.10 19.02,42.7 19.24,42.92 24.64,42.92 M32U-PORTD.5
N$18
  Top 0.254: IC3.10 72.64,39.21 69.02,35.59 69.02,30.43 67.5,28.91 Q2.1 67.4,27.78 C11.1
N$19
  Top 0.254: C5.1 87.5,37.52 Q3.2
  Bottom 0.254: IC4.12 88.99,34.13 Q3.2
N$20
  Top 0.406: IC5.7 25.18,39.53 26.54,38.16 26.54,36.39 27,35.93 27,34.53 27.81,33.72 27.81,32.13 M32U-PORTD.2
N$21
  Top 0.406: IC5.20 11.54,37.93 10.03,39.43 10.03,47.37 M32U-PORTB.7 11.3,49.7 11.1,49.91 R6.2
N$22
  Top 0.406: IC5.6 25.02,38.73 25.91,37.84 25.91,36.07 26.3,35.68 26.3,34.28 27.18,33.4 27.18,30.23 M32U-PORTD.1 29.08,26.1 ISP.1
N$23
  Top 0.406: IC5.22 11.23,36.33 8.76,38.8 8.76,43.56 M32U-PORTC/SUPP.8
N$24
  Top 0.406: IC5.23 11.08,35.53 8.13,38.48 8.13,41.66 M32U-PORTC/SUPP.7
N$25
  Top 0.406: IC5.25 12.42,33.23 7.49,38.16 7.49,39.75 M32U-PORTC/SUPP.6
N$26
  Top 0.406: IC5.26 15.02,32.35 14.48,31.81 12.89,31.81 M32U-PORTC/SUPP.5
N$27  (via drill 0.4)
  Top 0.406: IC5.5 19.79,37.93 v19.56,38.16
  Bottom 0.406: v19.56,38.16 8.45,38.16 M32U-PORTC/SUPP.4
N$28
  Top 0.254: C13.1 86.55,28.09 Q3.1 86.65,31.59 IC4.13
N$29
  Top 0.254: IC2.4 58.61,54.45 54.8,50.64 Q1.2 54.7,47.15 C3.1
N$30
  Top 0.254: IC2.5 57.34,49.37 57.34,44.71 Q1.1 54.07,41.44 C6.1
N$31  (via drill 0.5)
  Top 0.254: v60.2,67.47 R4.1
  Bottom 0.254: SJ3.2 60.36,67.63 v60.2,67.47
N$32  (via drill 0.5)
  Top 0.254: v53.85,67.47 R3.1
  Bottom 0.254: SJ2.2 53.69,67.63 v53.85,67.47
N$33
  Top 0.406: A2.2 51,11.4 52.6,13 52.6,15.6 52.17,16.03 IC6.3
N$34
  Top 0.406: A1.2 52.4,8.4 52.4,11.6 53.4,12.6 53.4,16.6 51.43,18.57 IC6.2
N$35
  Top 0.254: EEPROM.2 62.92,13.49 60.15,13.49 | IC6.5 60.15,13.49 | 60.15,13.49 60.21,13.56 60.21,19.21 59.58,19.84 56.86,19.84 R12.1
  Bottom 0.254: EEPROM.6 64.83,17.94 64.83,15.4 EEPROM.2
N$36
  Top 0.254: R11.1 53.06,26.51 53.37,26.83 57.85,26.83 62.93,21.75 EEPROM.8
  Bottom 0.254: EEPROM.8 62.28,20.48 62.28,17.94 EEPROM.4 62.92,16.03 IC6.6
N$37
  Top 0.254: POTI1.S 106.87,72.23 109.98,69.12 109.98,65.88 111.95,63.91 111.95,62.07 ADC.4
N$38
  Top 0.254: ADC.2 113.22,63.68 110.68,66.22 POTI2.S
N$39
  Top 0.406: PROG.A 8.69,52.91 9.2,52.41 R6.1
N$40
  Top 0.406: R7.1 POWER.A
N$41
  Top 0.813: F1.2 20.14,12.78 L1.1
N$42
  Bottom 0.254: WP.2 IC6.7
N$43
  Top 0.406: IC5.1 21.31,33.55 22.03,32.84 Q4.1
N$44
  Top 0.406: IC5.2 22.19,35.53 22.48,35.23 Q4.3
N$45
  Bottom 0.254: SJ3.1 61.18,70.96 LED2.A
N$46
  Bottom 0.254: SJ2.1 54.51,70.96 LED1.A
N$47  (via drill 0.5)
  Top 0.254: v57.66,33.95 53.97,33.95 SPKR1.+
  Bottom 0.254: SJ4.1 61.29,30.32 v57.66,33.95
PD0  (via drill 0.5)
  Top 0.254: v78.17,56.64 v78.17,38.19
  Bottom 0.254: v78.17,56.64 75.28,59.53 IC3.2 70.23,59.53 69.02,60.74 65.15,60.74 63.94,59.53 IC2.2 58.36,59.53 57.09,60.8 45.59,60.8 44.1,59.31 44.1,58.31 42.29,56.5 39.48,56.5 SERIAL.3 | v78.17,38.19 78.42,37.94 82.74,37.94 83.5,37.18 83.5,30.83 85.28,29.05 IC4.14 95.41,29.05 101.76,35.4 107.95,35.4 110.03,37.48 121.92,37.48 122.68,36.72 122.68,32.36 EXTENSION.26
  Bottom 0.406: 2.2 1.1 | 1.1 | 1.1 34.76,56.24 36.7,54.3 SERIAL.3
PD1  (via drill 0.5)
  Top 0.254: v76.33,60.74 76.33,59.47 IC3.3 | v99.98,61.05 | 100.04,30.48 v100.14,30.38 99.98,30.54 v99.98,61.05
  Bottom 0.254: IC4.15 95.17,26.51 99.04,30.38 v100.14,30.38 100.2,30.32 112,30.32 113.08,31.4 113.9,31.4 116.69,28.61 EXTENSION.27 | IC3.3 71.18,56.99 69.85,58.32 66.29,58.32 64.96,56.99 IC2.3 58.1,56.99 56.83,58.26 46.07,58.26 44.4,56.59 44.4,55.4 43,54 39.52,54 SERIAL.1 | v76.33,60.74 76.39,60.8 82.74,60.8 84.01,59.53 89.09,59.53 90.36,60.8 99.73,60.8 v99.98,61.05
  Bottom 0.406: 2.1 1.2 | 1.2 | 1.2 32.36,53.76 33.6,55 34.8,55 35.4,54.4 35.4,52.48 SERIAL.1
PROG-RESET  (via drill 0.4)
  Top 0.406: IC5.24 13.9,34.73 v14.16,34.99 | R8.1 v12.57,30.54 9.71,33.4 M32U-PORTC/SUPP.3 | RST.2 v2.4,30.6
  Bottom 0.406: v14.16,34.99 14.16,32.13 v12.57,30.54 | 11.63,29.6 v12.57,30.54 | P-RST.1 24.8,22 23.4,23.4 13.4,23.4 11.4,25.4 11.4,29.37 v12.57,30.54 | v2.4,30.6 5.2,33.4 M32U-PORTC/SUPP.3
PROG-RXD
  Top 0.406: IC5.8 25.33,40.33 27.18,38.48 27.18,36.8 27.7,36.28 27.7,34.78 M32U-PORTD.3 32.1,36.42 32.1,42.93 34.16,44.99 SERIAL.2
  Bottom 0.406: R13.1 27.65,33.4 M32U-PORTD.3
PROG-TXD
  Top 0.406: IC5.9 24.79,41.82 27.81,38.8 27.81,37.21 M32U-PORTD.4 31.21,38.07 31.21,43.15 32.89,44.83 32.89,52.45 SERIAL.4
  Bottom 0.406: R14.1 28.39,35.94 M32U-PORTD.4
RXD  (via drill 0.4)
  Top 0.406: USART.5 25.28,55 v30.4,55
  Bottom 0.4: v30.4,55 31.57,55
  Bottom 0.406: 31.57,55 1.M
SCK  (via drill 0.4, 0.5)
  Top 0.254: IC2.19 65.17,57.2 65.17,44.42 v64.12,43.37 | v94.6,30.2 95,29.8 95,7.06 SPI.8
  Top 0.406: IC5.15 15.02,43.78 17.34,46.1 21.46,46.1 M32U-PORTB.2 | ISP-10.7 37.34,23.29 38.29,24.24 38.29,37.89 ISP-6.3
  Bottom 0.254: ISP-6.3 38.64,39.48 39.46,38.66 42.82,38.66 47.24,43.08 53.59,43.08 53.85,43.34 55.75,43.34 56.07,43.02 63.77,43.02 v64.12,43.37 64.47,43.02 75.08,43.02 78.89,39.21 IC3.19 82.23,39.21 | 82.23,39.21 84.66,41.64 87.46,41.64 90.11,44.29 IC4.8 104.17,44.29 105.44,43.02 117.92,43.02 118.38,42.56 120.19,42.56 EXTENSION.16 | IC2.19 65.98,59.53 64.71,58.26 58.23,58.26 56.96,59.53 IC1.7 | SPI.8 94.2,5.18 94.2,3 93.8,2.6 84.8,2.6 80,7.4 75.2,7.4 73,5.2 67.52,5.2 ISP-6/2.3 | 82.23,39.21 84,37.44 84,31 85.2,29.8 90,29.8 90.4,30.2 v94.6,30.2
  Bottom 0.406: ISP-6.3 35.43,40.75 33.41,40.75 32.87,41.29 32.87,45.03 30.5,47.4 27.7,47.4 27.5,47.2 25.3,47.2 24,48.5 M32U-PORTB.2
SS  (via drill 0.4, 0.5)
  Top 0.254: v78.17,34.38 77.56,34.99 77.56,37.4 77.34,37.62 77.34,53.18 v77.09,53.43 | v103.89,51.72 103.89,57.18 104.97,58.26 108.33,58.26 112.01,54.58 v112.01,48.86 | IC1.2 52.01,54.7 v52.01,54.2 | IC3.16 79.59,31.59 79,31 79,28 70.88,19.88 v70.88,16.55 | v88.9,12.3 91.8,9.4 91.8,5.18 SPI.5
  Bottom 0.254: IC3.16 80.96,31.59 v78.17,34.38 | v52.01,54.2 58.1,48.1 61.47,48.1 65.28,51.91 IC2.16 69.79,51.91 70.99,53.12 76.77,53.12 v77.09,53.43 77.47,53.81 79.56,53.81 80.2,53.18 82.87,53.18 84.14,51.91 IC4.5 103.69,51.91 v103.89,51.72 | v112.01,48.86 114.49,46.39 EXTENSION.13 | v70.88,16.55 70.88,15.82 74.5,12.2 88.8,12.2 v88.9,12.3
TXD
  Bottom 0.406: 2.M 22.77,55.03 USART.4

### Text on the board
tPlace: V1.2 | http://ateval.eHaJo.de | GND | !CTS | VCC | TXD | RXD | !RTS | TxD | RxD | RxD | TxD | 5V | EEPROM | LDO | 0 | 1 | 0 | 1 | 0 | 1
tNames: P2 | P1 | eHaJo.de
bNames: LED1 | LED2 | SPKR | WP
bStop: PIN | EXTRA | ISP-10 | ISP-6 | PIN | LED1 | LED2 | PD2 | S1 | 9 | 1 | MISO | PD3 | S2 | 2 | 2 | VCC | PD4 | S3 | 7 | 3 | SCK | PD6 | LED1 | 1 | 4 | MOSI | PD5 | LED2 | 5 | 5 | RESET | PD7 | SUMMER | 4,6,8,10 | 6 | GND | 2 | 1 | SPKR | GND | RST | D+ | D- | WP | +5V